# EAGLE design SpecialistEE20 (EAGLE 6.4)

## Sheet 1 of 4
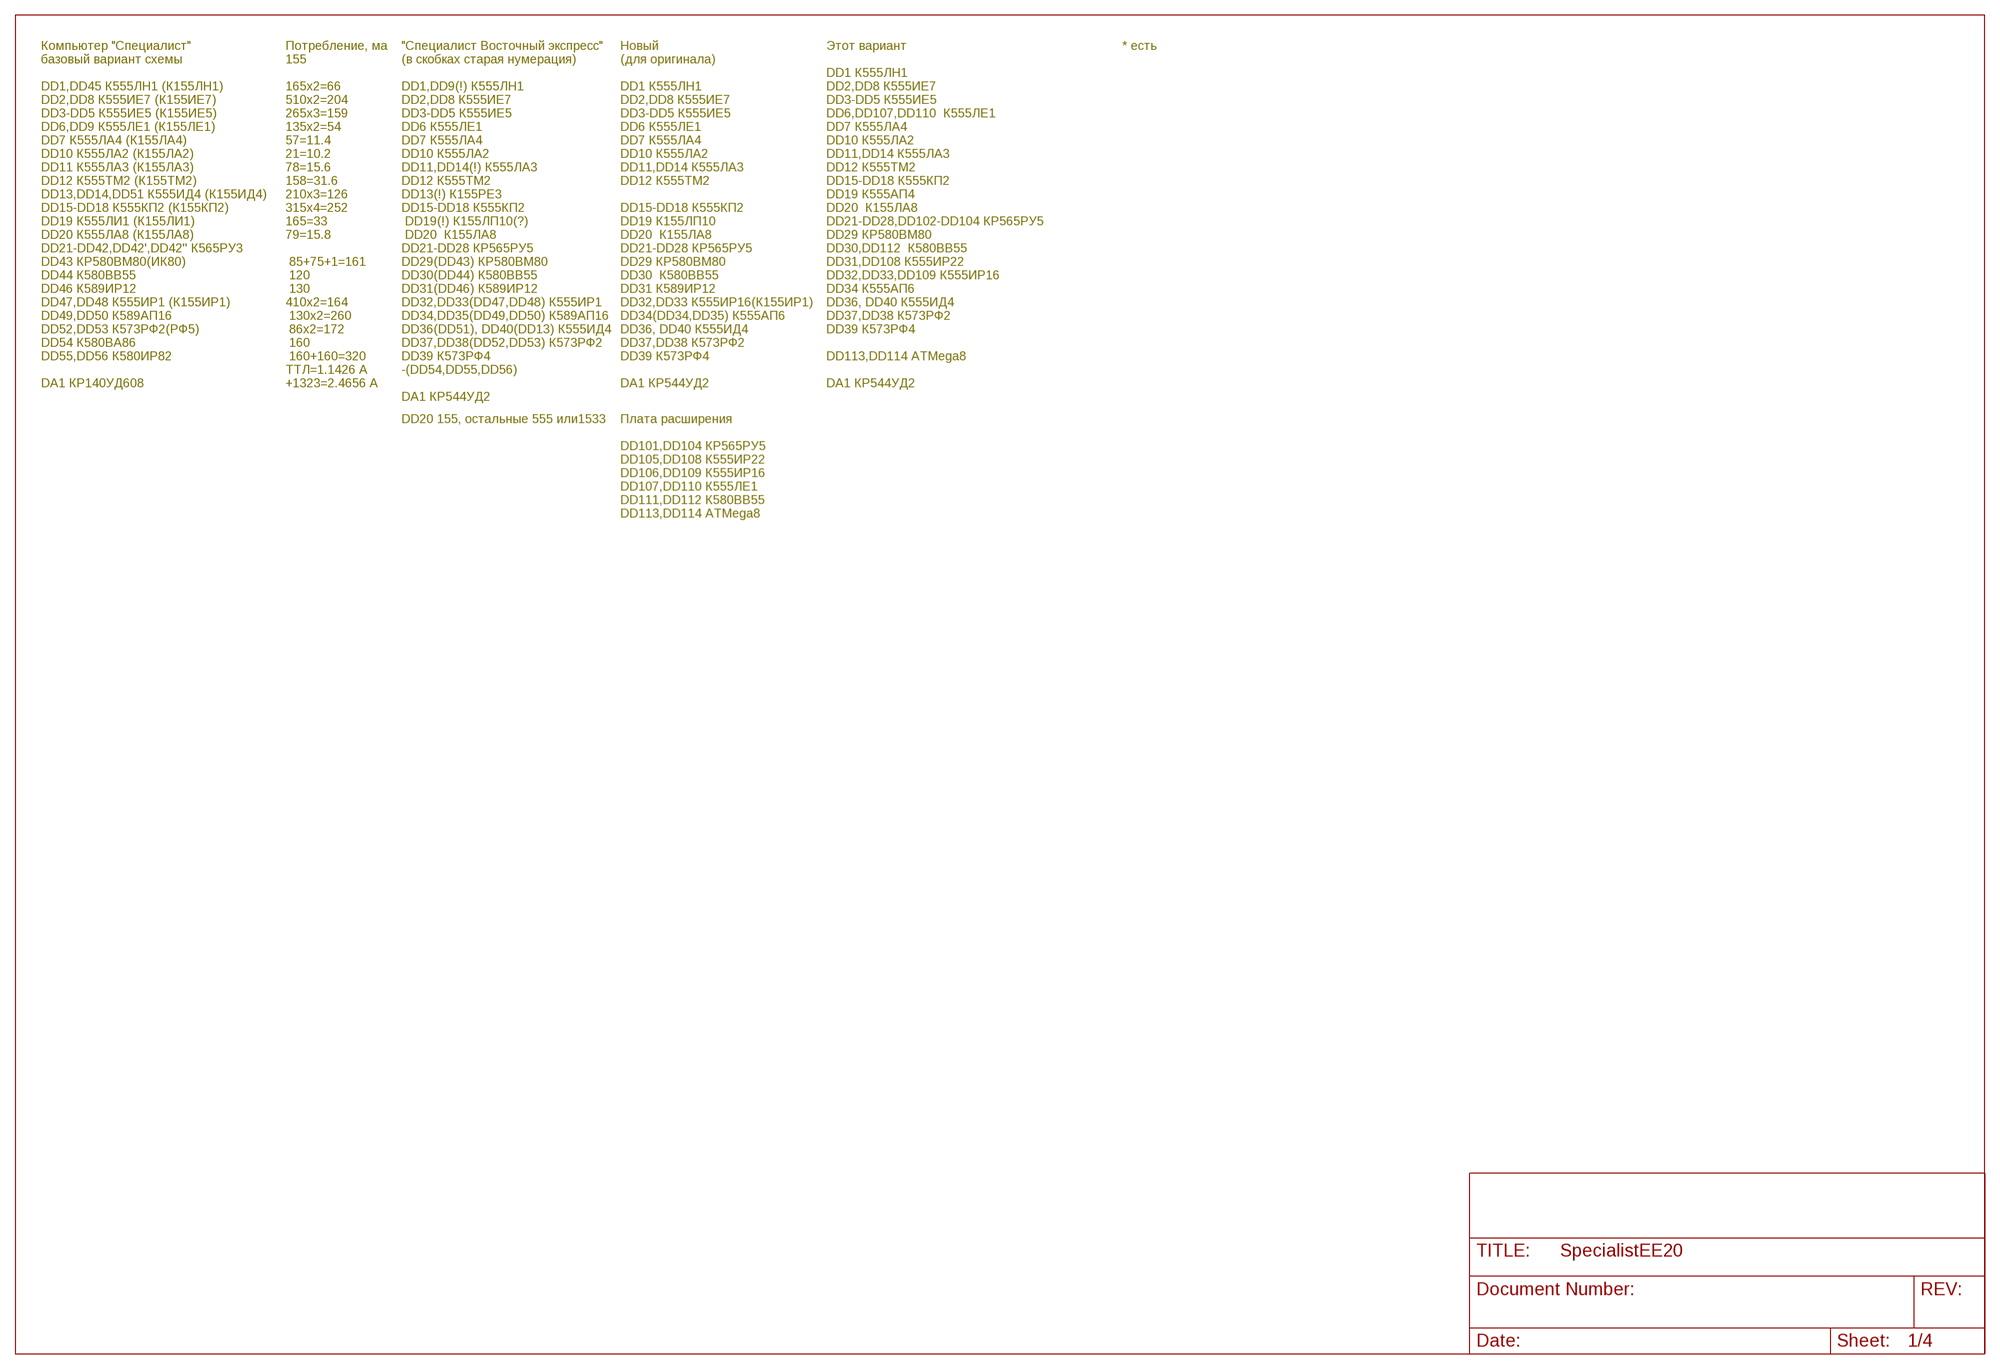
[diagram p0: schematic, sheet 1]

### Notes on the sheet
- Компьютер "Специалист"
  базовый вариант схемы
  
  DD1,DD45 К555ЛН1 (К155ЛН1)
  DD2,DD8 К555ИЕ7 (К155ИЕ7)
  DD3-DD5 К555ИЕ5 (К155ИЕ5)
  DD6,DD9 К555ЛЕ1 (К155ЛЕ1)
  DD7 К555ЛА4 (К155ЛА4)
  DD10 К555ЛА2 (К155ЛА2)
  DD11 К555ЛА3 (К155ЛА3)
  DD12 К555ТМ2 (К155ТМ2)
  DD13,DD14,DD51 К555ИД4 (К155ИД4)
  DD15-DD18 К555КП2 (К155КП2)
  DD19 К555ЛИ1 (К155ЛИ1)
  DD20 К555ЛА8 (К155ЛА8)
  DD21-DD42,DD42',DD42'' К565РУ3
  DD43 КР580ВМ80(ИК80)
  DD44 К580ВВ55
  DD46 К589ИР12
  DD47,DD48 К555ИР1 (К155ИР1)
  DD49,DD50 К589АП16
  DD52,DD53 К573РФ2(РФ5)
  DD54 К580ВА86
  DD55,DD56 К580ИР82
  
  DA1 КР140УД608
- Потребление, ма
  155 
  
  165х2=66
  510х2=204
  265х3=159
  135х2=54
  57=11.4
  21=10.2
  78=15.6
  158=31.6
  210х3=126
  315х4=252
  165=33
  79=15.8
  
   85+75+1=161
   120
   130
  410х2=164
   130х2=260
   86х2=172
   160
   160+160=320
  ТТЛ=1.1426 А
  +1323=2.4656 А
- "Специалист Восточный экспресс"
  (в скобках старая нумерация)
  
  DD1,DD9(!) К555ЛН1
  DD2,DD8 К555ИЕ7
  DD3-DD5 К555ИЕ5
  DD6 К555ЛЕ1
  DD7 К555ЛА4
  DD10 К555ЛА2
  DD11,DD14(!) К555ЛА3
  DD12 К555ТМ2
  DD13(!) К155РЕ3
  DD15-DD18 К555КП2
   DD19(!) К155ЛП10(?)
   DD20  К155ЛА8
  DD21-DD28 КР565РУ5
  DD29(DD43) КР580ВМ80
  DD30(DD44) К580ВВ55
  DD31(DD46) К589ИР12
  DD32,DD33(DD47,DD48) К555ИР1
  DD34,DD35(DD49,DD50) К589АП16
  DD36(DD51), DD40(DD13) К555ИД4 
  DD37,DD38(DD52,DD53) К573РФ2
  DD39 К573РФ4
  -(DD54,DD55,DD56)
  
  DA1 КР544УД2
- Новый
  (для оригинала)
  
  DD1 К555ЛН1
  DD2,DD8 К555ИЕ7
  DD3-DD5 К555ИЕ5
  DD6 К555ЛЕ1
  DD7 К555ЛА4
  DD10 К555ЛА2
  DD11,DD14 К555ЛА3
  DD12 К555ТМ2
  
  DD15-DD18 К555КП2
  DD19 К155ЛП10
  DD20  К155ЛА8
  DD21-DD28 КР565РУ5
  DD29 КР580ВМ80
  DD30  К580ВВ55
  DD31 К589ИР12
  DD32,DD33 К555ИР16(К155ИР1)
  DD34(DD34,DD35) К555АП6
  DD36, DD40 К555ИД4 
  DD37,DD38 К573РФ2
  DD39 К573РФ4
  
  DA1 КР544УД2
- Этот вариант
  
  DD1 К555ЛН1
  DD2,DD8 К555ИЕ7
  DD3-DD5 К555ИЕ5
  DD6,DD107,DD110  К555ЛЕ1
  DD7 К555ЛА4
  DD10 К555ЛА2
  DD11,DD14 К555ЛА3
  DD12 К555ТМ2
  DD15-DD18 К555КП2
  DD19 К555АП4
  DD20  К155ЛА8
  DD21-DD28,DD102-DD104 КР565РУ5
  DD29 КР580ВМ80
  DD30,DD112  К580ВВ55
  DD31,DD108 К555ИР22
  DD32,DD33,DD109 К555ИР16
  DD34 К555АП6
  DD36, DD40 К555ИД4 
  DD37,DD38 К573РФ2
  DD39 К573РФ4
  
  DD113,DD114 ATMega8
  
  DA1 КР544УД2
- * есть
- DD20 155, остальные 555 или1533
- Плата расширения
  
  DD101,DD104 КР565РУ5
  DD105,DD108 К555ИР22
  DD106,DD109 К555ИР16
  DD107,DD110 К555ЛЕ1
  DD111,DD112 К580ВВ55
  DD113,DD114 ATMega8

## Sheet 2 of 4
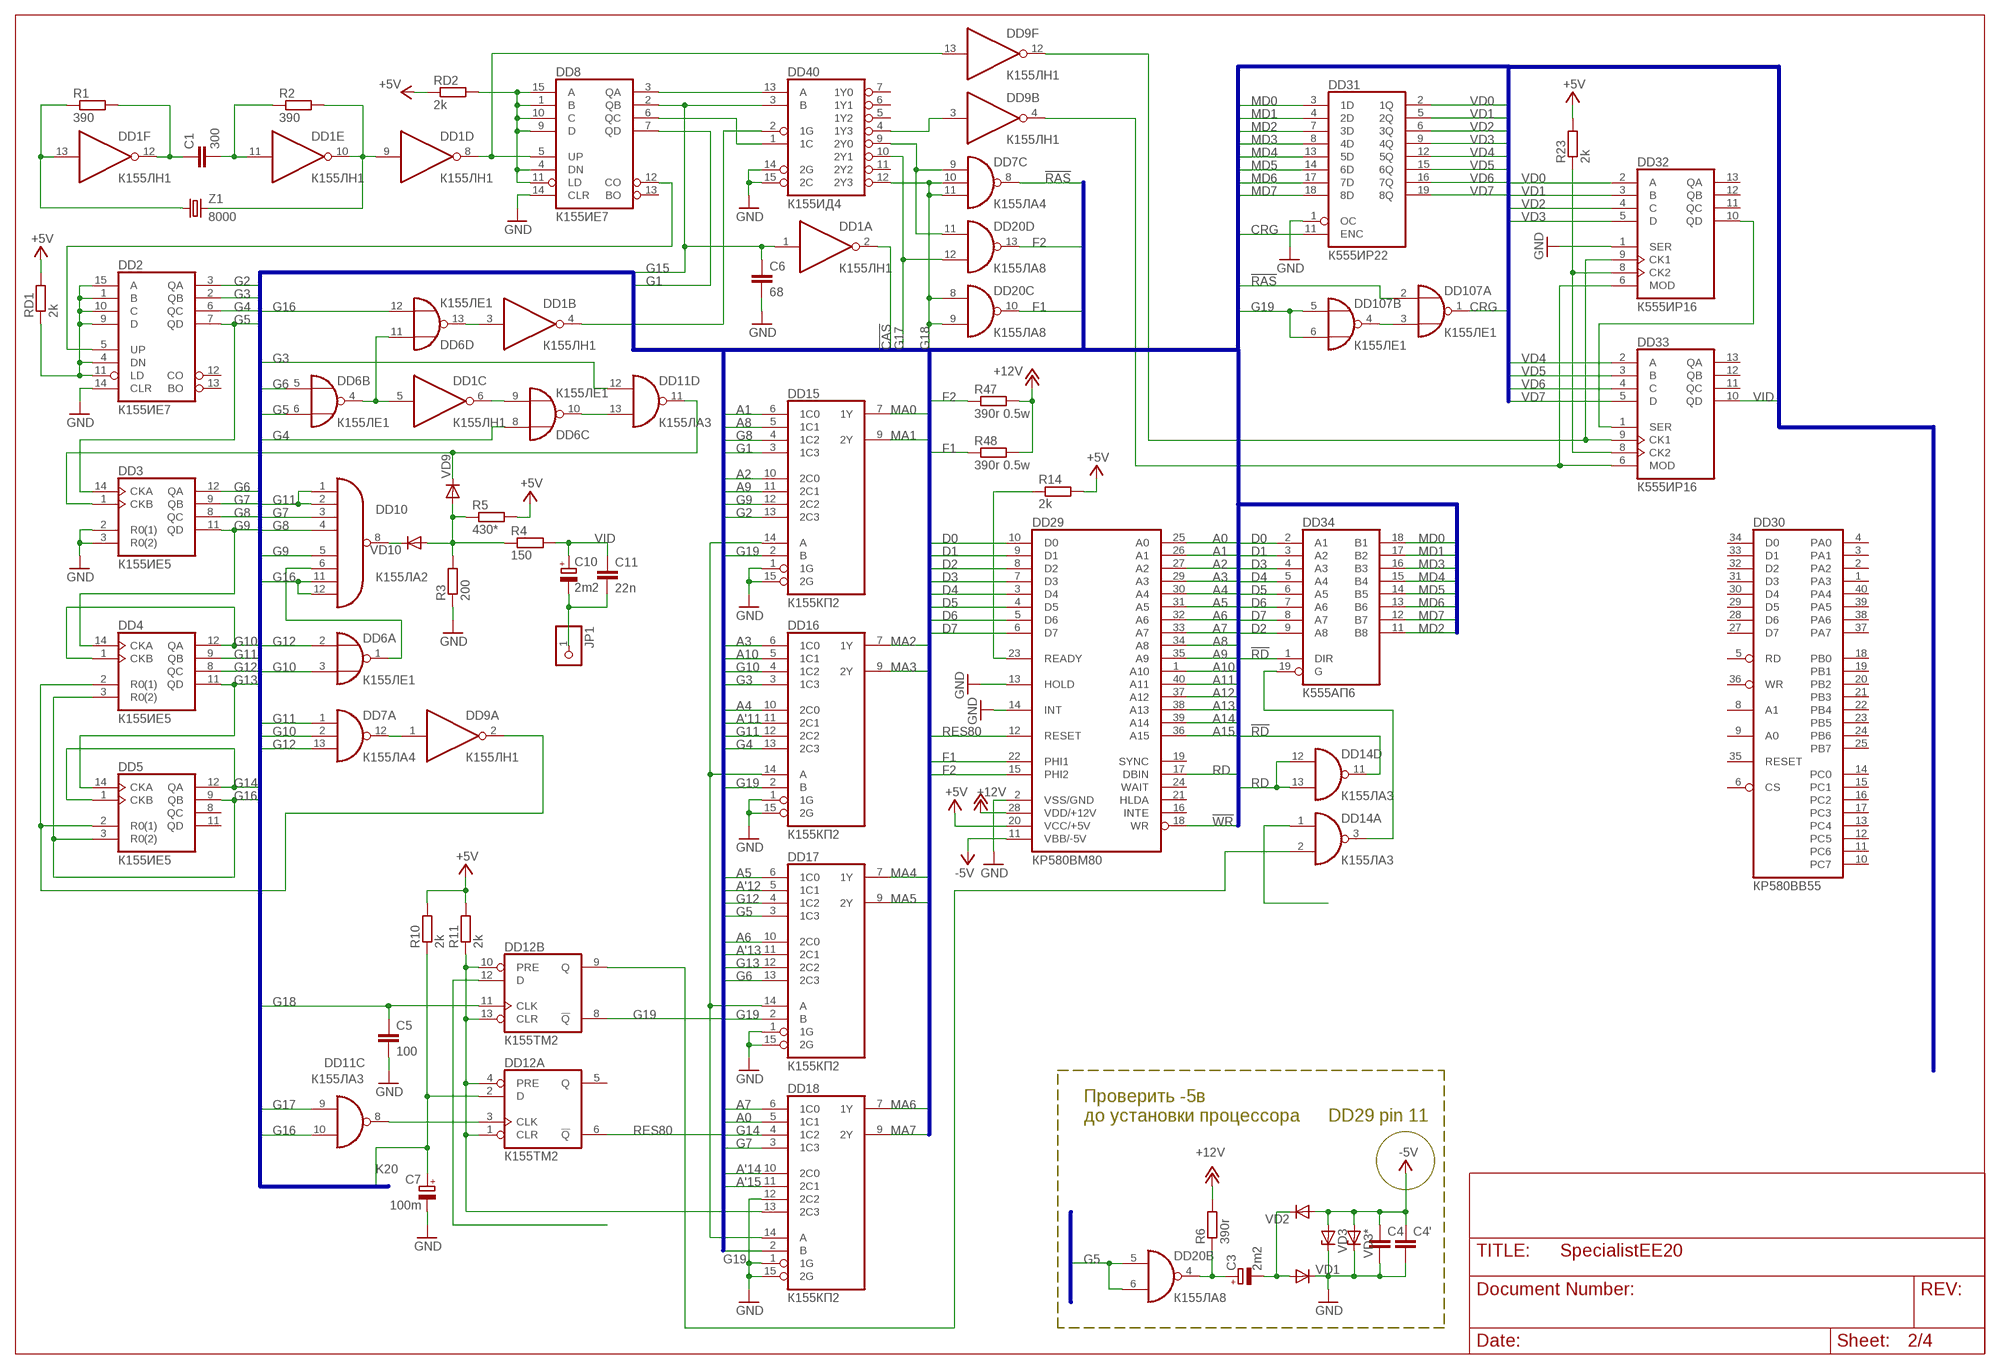
[diagram p1: schematic, sheet 2]

### Parts
C1  300  C-EUC0805  [C0805]
C3  2m2  CPOL-EUE2.5-5  [E2,5-5]
C4  C-EUC1206  [C1206]
C4'  C-EUC1206  [C1206]
C5  100  C-EUC0805  [C0805]
C6  68  C-EUC0805  [C0805]
C7  100m  CPOL-EUE2.5-5  [E2,5-5]
C10  2m2  CPOL-EUE2.5-5  [E2,5-5]
C11  22n  C-EUC0805  [C0805]
DD1  К155ЛН1  7404N  [DIL14]
DD2  К155ИЕ7  74192N  [DIL16]
DD3  К155ИЕ5  74LS93N  [DIL14]
DD4  К155ИЕ5  74LS93N  [DIL14]
DD5  К155ИЕ5  74LS93N  [DIL14]
DD6  К155ЛЕ1  7402N  [DIL14]
DD7  К155ЛА4  7410N  [DIL14]
DD8  К155ИЕ7  74192N  [DIL16]
DD9  К155ЛН1  7404N  [DIL14]
DD10  К155ЛА2  7430N  [DIL14]
DD11  К155ЛА3  7400N  [DIL14]
DD12  К155ТМ2  74S74N  [DIL14]
DD14  К155ЛА3  7400N  [DIL14]
DD15  К155КП2  74S153N  [DIL16]
DD16  К155КП2  74S153N  [DIL16]
DD17  К155КП2  74S153N  [DIL16]
DD18  К155КП2  74S153N  [DIL16]
DD20  К155ЛА8  74LS01N  [DIL14]
DD29  КР580ВМ80  8080  [DIL40]
DD30  КР580ВВ55  8255A  [DIL40]
DD31  К555ИР22  74LS373N  [DIL20]
DD32  К555ИР16  7495N  [DIL14]
DD33  К555ИР16  7495N  [DIL14]
DD34  К555АП6  74LS245N  [DIL20]
DD40  К155ИД4  74LS155N  [DIL16]
DD107  К155ЛЕ1  7402N  [DIL14]
JP1  PINHD-1X1  [1X01]
R1  390  R-EU_M1206  [M1206]
R2  390  R-EU_M1206  [M1206]
R3  200  R-EU_M1206  [M1206]
R4  150  R-EU_M1206  [M1206]
R5  430*  R-EU_M1206  [M1206]
R6  390r  R-EU_0411/15  [0411/15]
R10  2k  R-EU_M1206  [M1206]
R11  2k  R-EU_M1206  [M1206]
R14  2k  R-EU_M1206  [M1206]
R23  2k  R-EU_M1206  [M1206]
R47  390r 0.5w  R-EU_0411/15  [0411/15]
R48  390r 0.5w  R-EU_0411/15  [0411/15]
RD1  2k  R-EU_M1206  [M1206]
RD2  2k  R-EU_M1206  [M1206]
VD1  DIODE-SOD80C  [SOD80C]
VD2  DIODE-SOD80C  [SOD80C]
VD3  ZENER-DIODESOD80C  [SOD80C]
VD3*  ZENER-DIODESOD80C  [SOD80C]
VD9  DIODE-SOD80C  [SOD80C]
VD10  DIODE-SOD80C  [SOD80C]
Z1  8000  CRYSTALHC49S  [HC49/S]

### Nets
!CAS: DD1.2(A:O) ; also sheet 3,4
!RAS: DD7.8(C:O) DD107.2(A:I0) ; also sheet 3,4
!RD: DD14.11(D:O) DD34.1(DIR) ; also sheet 4
!WR: DD29.18(WR) ; also sheet 4
+5V: DD29.20(VCC/+5V) R5.2 R10.2 R11.2 R14.2 R23.2 RD1.2 RD2.1 ; also sheet 3,4
+12V: DD29.28(VDD/+12V) R6.2 R47.2 R48.2 ; also sheet 3
-5V: C4'.1 C4.1 DD29.11(VBB/-5V) VD2.A VD3*.A VD3.A
A0: DD18.5(1C1) DD29.25(A0) ; also sheet 4
A1: DD15.6(1C0) DD29.26(A1) ; also sheet 4
A2: DD15.10(2C0) DD29.27(A2)
A3: DD16.6(1C0) DD29.29(A3)
A4: DD16.10(2C0) DD29.30(A4)
A5: DD17.6(1C0) DD29.31(A5)
A6: DD17.10(2C0) DD29.32(A6)
A7: DD18.6(1C0) DD29.33(A7)
A8: DD15.5(1C1) DD29.34(A8)
A9: DD15.11(2C1) DD29.35(A9)
A10: DD16.5(1C1) DD29.1(A10)
A11: DD29.40(A11)
A12: DD29.37(A12)
A13: DD29.38(A13)
A14: DD29.39(A14)
A15: DD29.36(A15)
A'11: DD16.11(2C1)
A'12: DD17.5(1C1)
A'13: DD17.11(2C1)
A'14: DD18.10(2C0)
A'15: DD18.11(2C1)
CRG: DD31.11(ENC) DD107.1(A:O) ; also sheet 4
D0: DD29.10(D0) DD34.2(A1) ; also sheet 4
D1: DD29.9(D1) DD34.3(A2) ; also sheet 4
D2: DD29.8(D2) DD34.9(A8) ; also sheet 4
D3: DD29.7(D3) DD34.4(A3) ; also sheet 4
D4: DD29.3(D4) DD34.5(A4) ; also sheet 4
D5: DD29.4(D5) DD34.6(A5) ; also sheet 4
D6: DD29.5(D6) DD34.7(A6) ; also sheet 4
D7: DD29.6(D7) DD34.8(A7) ; also sheet 4
F1: DD20.10(C:O) DD29.22(PHI1) R48.1
F2: DD20.13(D:O) DD29.15(PHI2) R47.1
G1: DD8.7(QD) DD15.3(1C3)
G2: DD2.3(QA) DD15.13(2C3)
G3: DD2.2(QB) DD11.12(D:I0) DD16.3(1C3)
G4: DD2.6(QC) DD6.8(C:I0) DD16.13(2C3)
G5: DD2.7(QD) DD3.14(CKA) DD6.6(B:I1) DD17.3(1C3) DD20.5(B:I0) DD20.6(B:I1)
G6: DD3.12(QA) DD6.5(B:I0) DD17.13(2C3)
G7: DD3.9(QB) DD10.3(I2) DD18.3(1C3)
G8: DD3.8(QC) DD10.4(I3) DD15.4(1C2)
G9: DD3.11(QD) DD4.14(CKA) DD10.5(I4) DD15.12(2C2)
G10: DD4.1(CKB) DD4.12(QA) DD6.3(A:I1) DD7.2(A:I1) DD16.4(1C2)
G11: DD4.9(QB) DD7.1(A:I0) DD10.1(I0) DD10.2(I1) DD16.12(2C2)
G12: DD4.8(QC) DD6.2(A:I0) DD7.13(A:I2) DD17.4(1C2)
G13: DD4.11(QD) DD5.14(CKA) DD17.12(2C2)
G14: DD5.1(CKB) DD5.12(QA) DD18.4(1C2)
G15: C6.1 DD1.1(A:I) DD8.2(QB) DD40.3(B)
G16: DD4.3(R0(2)) DD5.3(R0(2)) DD5.9(QB) DD6.12(D:I1) DD10.11(I6) DD10.12(I7) DD11.10(C:I1)
G17: DD11.9(C:I0) DD20.12(D:I1) DD40.10(2Y1)
G18: C5.1 DD7.10(C:I1) DD7.11(C:I2) DD12.11(B:CLK) DD20.8(C:I0) DD20.9(C:I1) DD40.12(2Y3)
G19: DD12.8(B:!Q) DD15.2(B) DD16.2(B) DD17.2(B) DD18.2(B) DD107.5(B:I0) DD107.6(B:I1)
GND: C4'.2 C4.2 C5.2 C6.2 C7.- DD2.14(CLR) DD3.2(R0(1)) DD3.3(R0(2)) DD8.14(CLR) DD15.1(1G) DD15.15(2G) DD16.1(1G) DD16.15(2G) DD17.1(1G) DD17.15(2G) DD18.1(1G) DD18.12(2C2) DD18.15(2G) DD29.2(VSS/GND) DD29.13(HOLD) DD29.14(INT) DD31.1(OC) DD32.1(SER) DD40.14(2G) DD40.15(2C) R3.1 VD1.C VD3*.C VD3.C ; also sheet 3,4
K20: C7.+ DD12.2(A:D) R10.1
MA0: DD15.7(1Y) ; also sheet 3,4
MA1: DD15.9(2Y) ; also sheet 3,4
MA2: DD16.7(1Y) ; also sheet 3,4
MA3: DD16.9(2Y) ; also sheet 3,4
MA4: DD17.7(1Y) ; also sheet 3,4
MA5: DD17.9(2Y) ; also sheet 3,4
MA6: DD18.7(1Y) ; also sheet 3,4
MA7: DD18.9(2Y) ; also sheet 3,4
MD0: DD31.3(1D) DD34.18(B1) ; also sheet 3
MD1: DD31.4(2D) DD34.17(B2) ; also sheet 3
MD2: DD31.7(3D) DD34.11(B8) ; also sheet 3
MD3: DD31.8(4D) DD34.16(B3) ; also sheet 3
MD4: DD31.13(5D) DD34.15(B4) ; also sheet 3
MD5: DD31.14(6D) DD34.14(B5) ; also sheet 3
MD6: DD31.17(7D) DD34.13(B6) ; also sheet 3
MD7: DD31.18(8D) DD34.12(B7) ; also sheet 3
N$1: DD6.10(C:O) DD11.13(D:I1)
N$2: DD1.5(C:I) DD6.4(B:O) DD6.11(D:I0)
N$3: DD1.13(F:I) R1.1 Z1.1
N$4: DD9.3(B:I) DD40.4(1Y3)
N$5: C1.1 DD1.12(F:O) R1.2
N$6: DD1.9(D:I) DD1.10(E:O) R2.2 Z1.2
N$7: C1.2 DD1.11(E:I) R2.1
N$8: DD1.8(D:O) DD8.5(UP) DD9.13(F:I)
N$11: DD2.5(UP) DD8.12(CO)
N$12: DD6.1(A:O) DD10.6(I5)
N$13: DD1.6(C:O) DD6.9(C:I1)
N$14: DD1.3(B:I) DD6.13(D:O)
N$16: DD4.2(R0(1)) DD5.2(R0(1)) DD9.2(A:O)
N$19: DD7.9(C:I0) DD20.11(D:I0) DD40.9(2Y0)
N$20: DD8.3(QA) DD40.13(A)
N$21: C3.+ DD20.4(B:O) R6.1
N$22: C3.- VD1.A VD2.C
N$23: DD8.6(QC) DD40.1(1C)
N$24: DD1.4(B:O) DD40.2(1G)
N$25: DD10.8(O) VD10.C
N$26: DD3.1(CKB) DD11.11(D:O) VD9.C
N$27: R3.2 R4.1 R5.1 VD9.A VD10.A
N$28: DD32.10(QD) DD33.1(SER)
N$29: DD2.1(B) DD2.4(DN) DD2.9(D) DD2.10(C) DD2.11(LD) DD2.15(A) RD1.1
N$31: DD12.1(A:CLR) DD12.4(A:PRE) DD12.10(B:PRE) DD12.13(B:CLR) DD18.13(2C3) R11.1
N$33: C10.- C11.2 JP1.1
N$34: DD11.8(C:O) DD12.3(A:CLK)
N$36: DD12.12(B:D)
N$37: DD7.12(A:O) DD9.1(A:I)
N$38: DD8.1(B) DD8.4(DN) DD8.9(D) DD8.10(C) DD8.11(LD) DD8.15(A) RD2.2
N$41: DD15.14(A) DD16.14(A) DD17.14(A) DD18.14(A)
N$44: DD107.3(A:I1) DD107.4(B:O)
N$49: DD32.8(CK2) DD33.8(CK2) R23.1
N$53: DD9.12(F:O) DD32.9(CK1) DD33.9(CK1)
N$57: DD9.4(B:O) DD32.6(MOD) DD33.6(MOD)
N$66: DD29.23(READY) R14.1
N$69: DD14.3(A:O) DD34.19(G)
N$70: DD12.9(B:Q) DD14.2(A:I1)
N$71: DD14.1(A:I0)
RD: DD14.12(D:I0) DD14.13(D:I1) DD29.17(DBIN)
RES80: DD12.6(A:!Q) DD29.12(RESET)
VD0: DD31.2(1Q) DD32.2(A)
VD1: DD31.5(2Q) DD32.3(B)
VD2: DD31.6(3Q) DD32.4(C)
VD3: DD31.9(4Q) DD32.5(D)
VD4: DD31.12(5Q) DD33.2(A)
VD5: DD31.15(6Q) DD33.3(B)
VD6: DD31.16(7Q) DD33.4(C)
VD7: DD31.19(8Q) DD33.5(D)
VID: C10.+ C11.1 DD33.10(QD) R4.2 ; also sheet 4
Unconnected: DD2.12(CO) DD2.13(BO) DD5.8(QC) DD5.11(QD) DD7.3(B:I0) DD7.4(B:I1) DD7.5(B:I2) DD7.6(B:O) DD8.13(BO) DD9.5(C:I) DD9.6(C:O) DD9.8(D:O) DD9.9(D:I) DD9.10(E:O) DD9.11(E:I) DD11.1(A:I0) DD11.2(A:I1) DD11.3(A:O) DD11.4(B:I0) DD11.5(B:I1) DD11.6(B:O) DD12.5(A:Q) DD14.4(B:I0) DD14.5(B:I1) DD14.6(B:O) DD14.8(C:O) DD14.9(C:I0) DD14.10(C:I1) DD20.1(A:O) DD20.2(A:I0) DD20.3(A:I1) DD29.16(INTE) DD29.19(SYNC) DD29.21(HLDA) DD29.24(WAIT) DD30.1(PA3) DD30.2(PA2) DD30.3(PA1) DD30.4(PA0) DD30.5(RD) DD30.6(CS) DD30.8(A1) DD30.9(A0) DD30.10(PC7) DD30.11(PC6) DD30.12(PC5) DD30.13(PC4) DD30.14(PC0) DD30.15(PC1) DD30.16(PC2) DD30.17(PC3) DD30.18(PB0) DD30.19(PB1) DD30.20(PB2) DD30.21(PB3) DD30.22(PB4) DD30.23(PB5) DD30.24(PB6) DD30.25(PB7) DD30.27(D7) DD30.28(D6) DD30.29(D5) DD30.30(D4) DD30.31(D3) DD30.32(D2) DD30.33(D1) DD30.34(D0) DD30.35(RESET) DD30.36(WR) DD30.37(PA7) DD30.38(PA6) DD30.39(PA5) DD30.40(PA4) DD32.11(QC) DD32.12(QB) DD32.13(QA) DD33.11(QC) DD33.12(QB) DD33.13(QA) DD40.5(1Y2) DD40.6(1Y1) DD40.7(1Y0) DD40.11(2Y2)

### Buses
A[0..15],A'[11..15],D[0..7],F[1..2],G[1..19],MA[0..7],MD[0..7],VD[0..11],!RAS,!CAS,CLK,!WE,!WR,X-----X,K[1..27],U7,!,U[6..7],!RESIN,RES,RES80,RD,!RD,B,G,R,B0,G0,R0,SND,VID,LED,P[1..24],R[1..2],CRG,SH,Q3

### Notes on the sheet
- Проверить -5в 
  до установки процессора
- DD29 pin 11

## Sheet 3 of 4
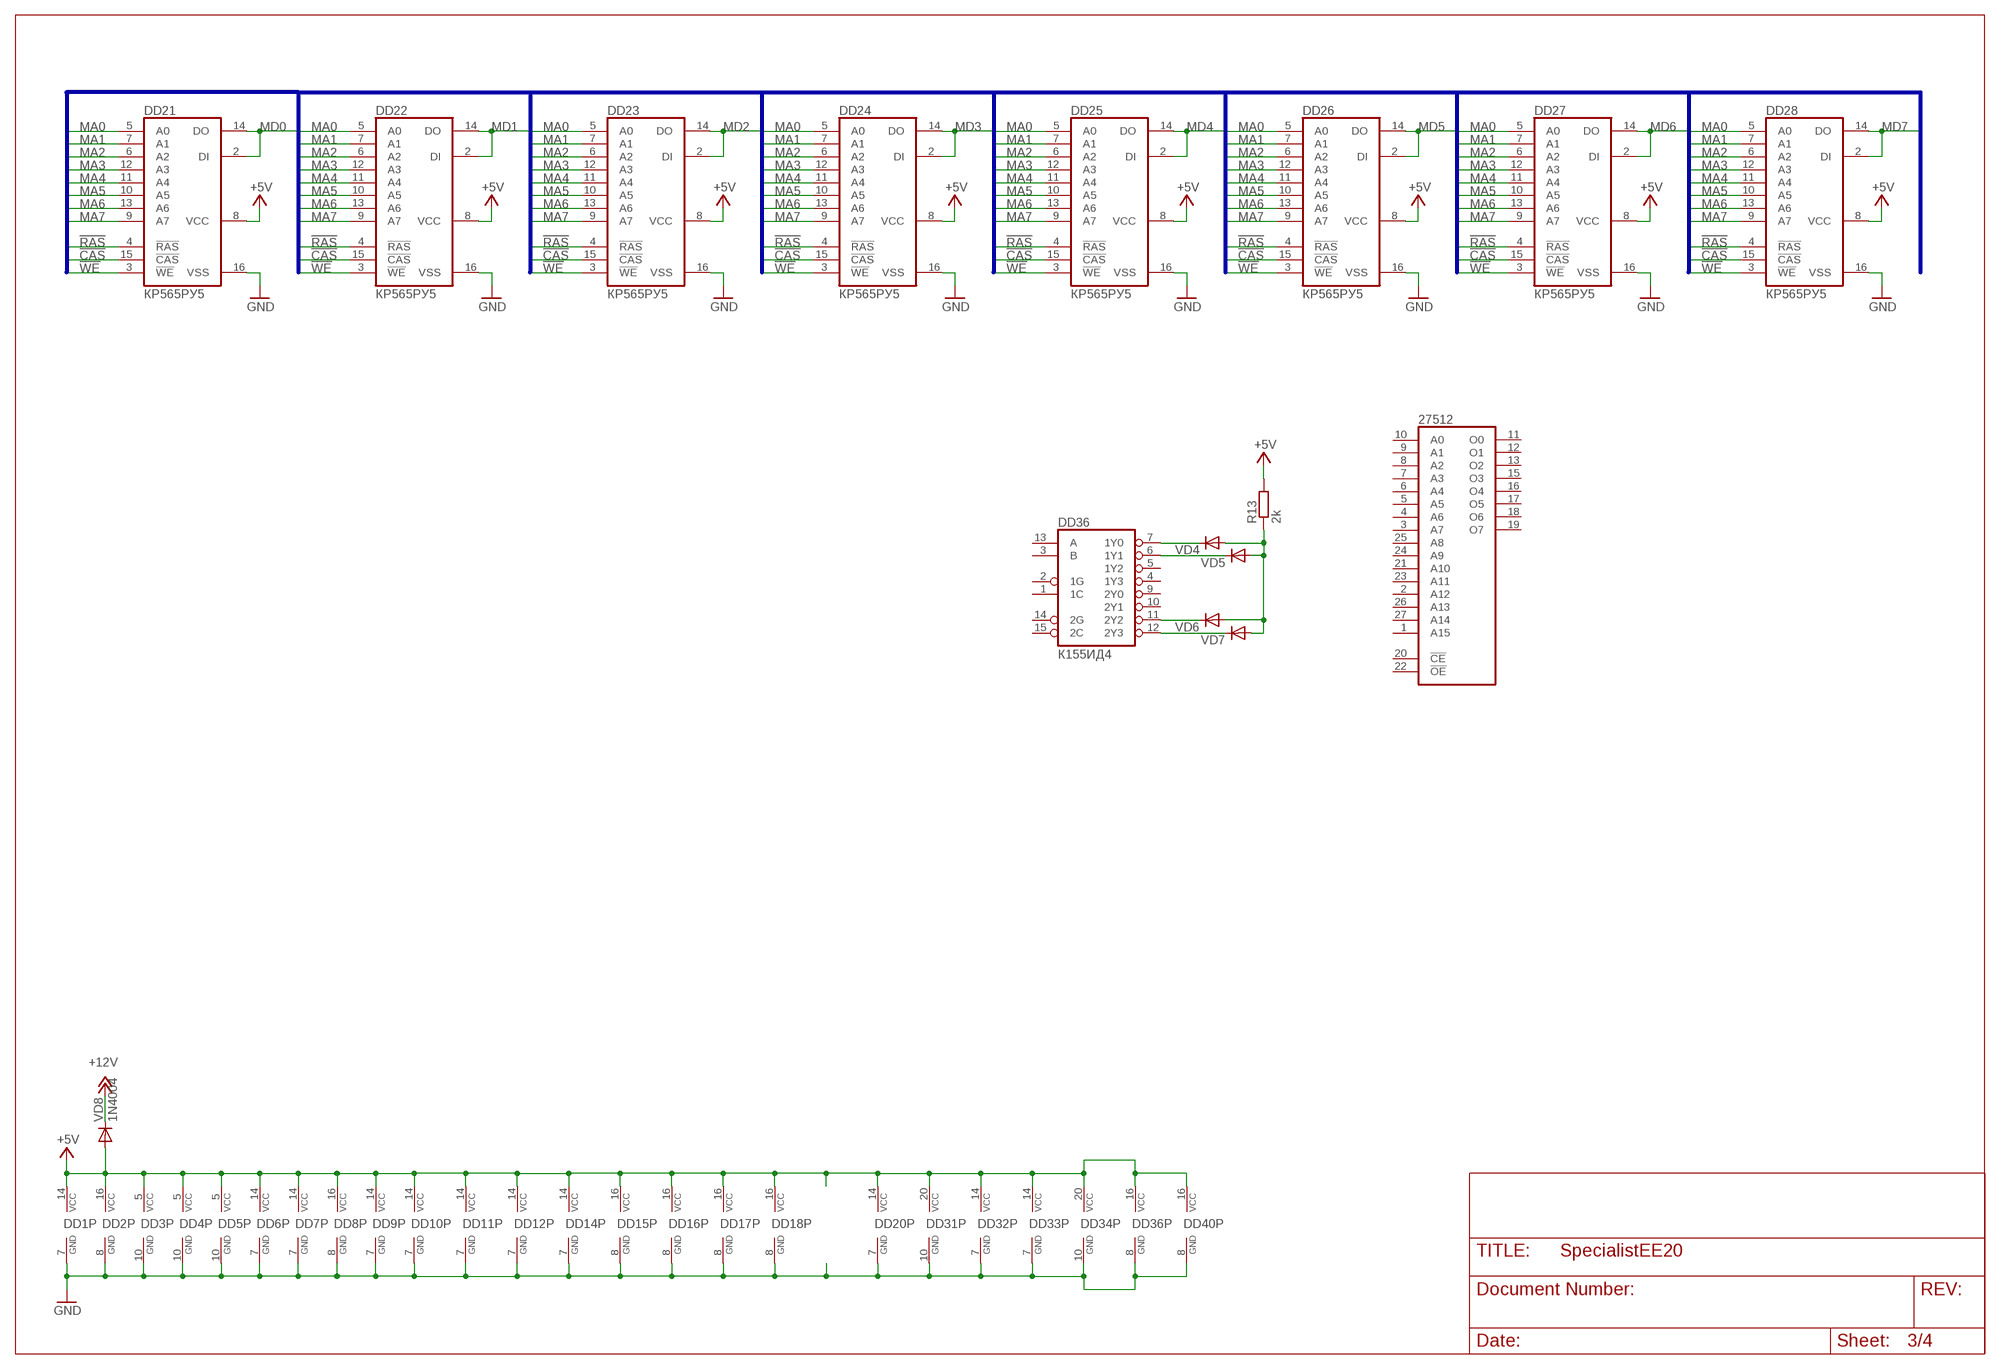
[diagram p2: schematic, sheet 3]

### Parts
27512  27512  [DIL28]
DD21  КР565РУ5  2164  [DIL16]
DD22  КР565РУ5  2164  [DIL16]
DD23  КР565РУ5  2164  [DIL16]
DD24  КР565РУ5  2164  [DIL16]
DD25  КР565РУ5  2164  [DIL16]
DD26  КР565РУ5  2164  [DIL16]
DD27  КР565РУ5  2164  [DIL16]
DD28  КР565РУ5  2164  [DIL16]
DD36  К155ИД4  74LS155N  [DIL16]
R13  2k  R-EU_M1206  [M1206]
VD4  DIODE-SOD80C  [SOD80C]
VD5  DIODE-SOD80C  [SOD80C]
VD6  DIODE-SOD80C  [SOD80C]
VD7  DIODE-SOD80C  [SOD80C]
VD8  1N4004  [DO41-10]

### Nets
!CAS: DD21.15(!CAS) DD22.15(!CAS) DD23.15(!CAS) DD24.15(!CAS) DD25.15(!CAS) DD26.15(!CAS) DD27.15(!CAS) DD28.15(!CAS) ; also sheet 2,4
!RAS: DD21.4(!RAS) DD22.4(!RAS) DD23.4(!RAS) DD24.4(!RAS) DD25.4(!RAS) DD26.4(!RAS) DD27.4(!RAS) DD28.4(!RAS) ; also sheet 2,4
!WE: DD21.3(!WE) DD22.3(!WE) DD23.3(!WE) DD24.3(!WE) DD25.3(!WE) DD26.3(!WE) DD27.3(!WE) DD28.3(!WE) ; also sheet 4
+5V: DD1.14(P:VCC) DD2.16(VCC) DD3.5(VCC) DD4.5(VCC) DD5.5(VCC) DD6.14(P:VCC) DD7.14(P:VCC) DD8.16(VCC) DD9.14(P:VCC) DD10.14(VCC) DD11.14(P:VCC) DD12.14(P:VCC) DD14.14(P:VCC) DD15.16(VCC) DD16.16(VCC) DD17.16(VCC) DD18.16(VCC) DD20.14(P:VCC) DD21.8(VCC) DD22.8(VCC) DD23.8(VCC) DD24.8(VCC) DD25.8(VCC) DD26.8(VCC) DD27.8(VCC) DD28.8(VCC) DD31.20(VCC) DD32.14(VCC) DD33.14(VCC) DD34.20(VCC) DD36.16(VCC) DD40.16(VCC) R13.2 VD8.A ; also sheet 2,4
+12V: VD8.C ; also sheet 2
GND: DD1.7(P:GND) DD2.8(GND) DD3.10(GND) DD4.10(GND) DD5.10(GND) DD6.7(P:GND) DD7.7(P:GND) DD8.8(GND) DD9.7(P:GND) DD10.7(GND) DD11.7(P:GND) DD12.7(P:GND) DD14.7(P:GND) DD15.8(GND) DD16.8(GND) DD17.8(GND) DD18.8(GND) DD20.7(P:GND) DD21.16(VSS) DD22.16(VSS) DD23.16(VSS) DD24.16(VSS) DD25.16(VSS) DD26.16(VSS) DD27.16(VSS) DD28.16(VSS) DD31.10(GND) DD32.7(GND) DD33.7(GND) DD34.10(GND) DD36.8(GND) DD40.8(GND) ; also sheet 2,4
MA0: DD21.5(A0) DD22.5(A0) DD23.5(A0) DD24.5(A0) DD25.5(A0) DD26.5(A0) DD27.5(A0) DD28.5(A0) ; also sheet 2,4
MA1: DD21.7(A1) DD22.7(A1) DD23.7(A1) DD24.7(A1) DD25.7(A1) DD26.7(A1) DD27.7(A1) DD28.7(A1) ; also sheet 2,4
MA2: DD21.6(A2) DD22.6(A2) DD23.6(A2) DD24.6(A2) DD25.6(A2) DD26.6(A2) DD27.6(A2) DD28.6(A2) ; also sheet 2,4
MA3: DD21.12(A3) DD22.12(A3) DD23.12(A3) DD24.12(A3) DD25.12(A3) DD26.12(A3) DD27.12(A3) DD28.12(A3) ; also sheet 2,4
MA4: DD21.11(A4) DD22.11(A4) DD23.11(A4) DD24.11(A4) DD25.11(A4) DD26.11(A4) DD27.11(A4) DD28.11(A4) ; also sheet 2,4
MA5: DD21.10(A5) DD22.10(A5) DD23.10(A5) DD24.10(A5) DD25.10(A5) DD26.10(A5) DD27.10(A5) DD28.10(A5) ; also sheet 2,4
MA6: DD21.13(A6) DD22.13(A6) DD23.13(A6) DD24.13(A6) DD25.13(A6) DD26.13(A6) DD27.13(A6) DD28.13(A6) ; also sheet 2,4
MA7: DD21.9(A7) DD22.9(A7) DD23.9(A7) DD24.9(A7) DD25.9(A7) DD26.9(A7) DD27.9(A7) DD28.9(A7) ; also sheet 2,4
MD0: DD21.2(DI) DD21.14(DO) ; also sheet 2
MD1: DD22.2(DI) DD22.14(DO) ; also sheet 2
MD2: DD23.2(DI) DD23.14(DO) ; also sheet 2
MD3: DD24.2(DI) DD24.14(DO) ; also sheet 2
MD4: DD25.2(DI) DD25.14(DO) ; also sheet 2
MD5: DD26.2(DI) DD26.14(DO) ; also sheet 2
MD6: DD27.2(DI) DD27.14(DO) ; also sheet 2
MD7: DD28.2(DI) DD28.14(DO) ; also sheet 2
N$9: DD36.7(1Y0) VD4.C
N$10: DD36.6(1Y1) VD5.C
N$15: DD36.11(2Y2) VD6.C
N$17: DD36.12(2Y3) VD7.C
N$18: R13.1 VD4.A VD5.A VD6.A VD7.A
Unconnected: 27512.1(A15) 27512.2(A12) 27512.3(A7) 27512.4(A6) 27512.5(A5) 27512.6(A4) 27512.7(A3) 27512.8(A2) 27512.9(A1) 27512.10(A0) 27512.11(O0) 27512.12(O1) 27512.13(O2) 27512.15(O3) 27512.16(O4) 27512.17(O5) 27512.18(O6) 27512.19(O7) 27512.20(!CE) 27512.21(A10) 27512.22(!OE) 27512.23(A11) 27512.24(A9) 27512.25(A8) 27512.26(A13) 27512.27(A14) DD36.1(1C) DD36.2(1G) DD36.3(B) DD36.4(1Y3) DD36.5(1Y2) DD36.9(2Y0) DD36.10(2Y1) DD36.13(A) DD36.14(2G) DD36.15(2C)

### Buses
A[0..15],A'[11..15],D[0..7],F[1..2],G[1..19],MA[0..7],MD[0..7],VD[0..11],!RAS,!CAS,CLK,!WE,!WR,X-----X,K[1..27],U7,!,U[6..7],!RESIN,RES,RES80,RD,!RD,B,G,R,B0,G0,R0,SND,VID,LED,P[1..24],R[1..2],CRG,SH,Q3

## Sheet 4 of 4
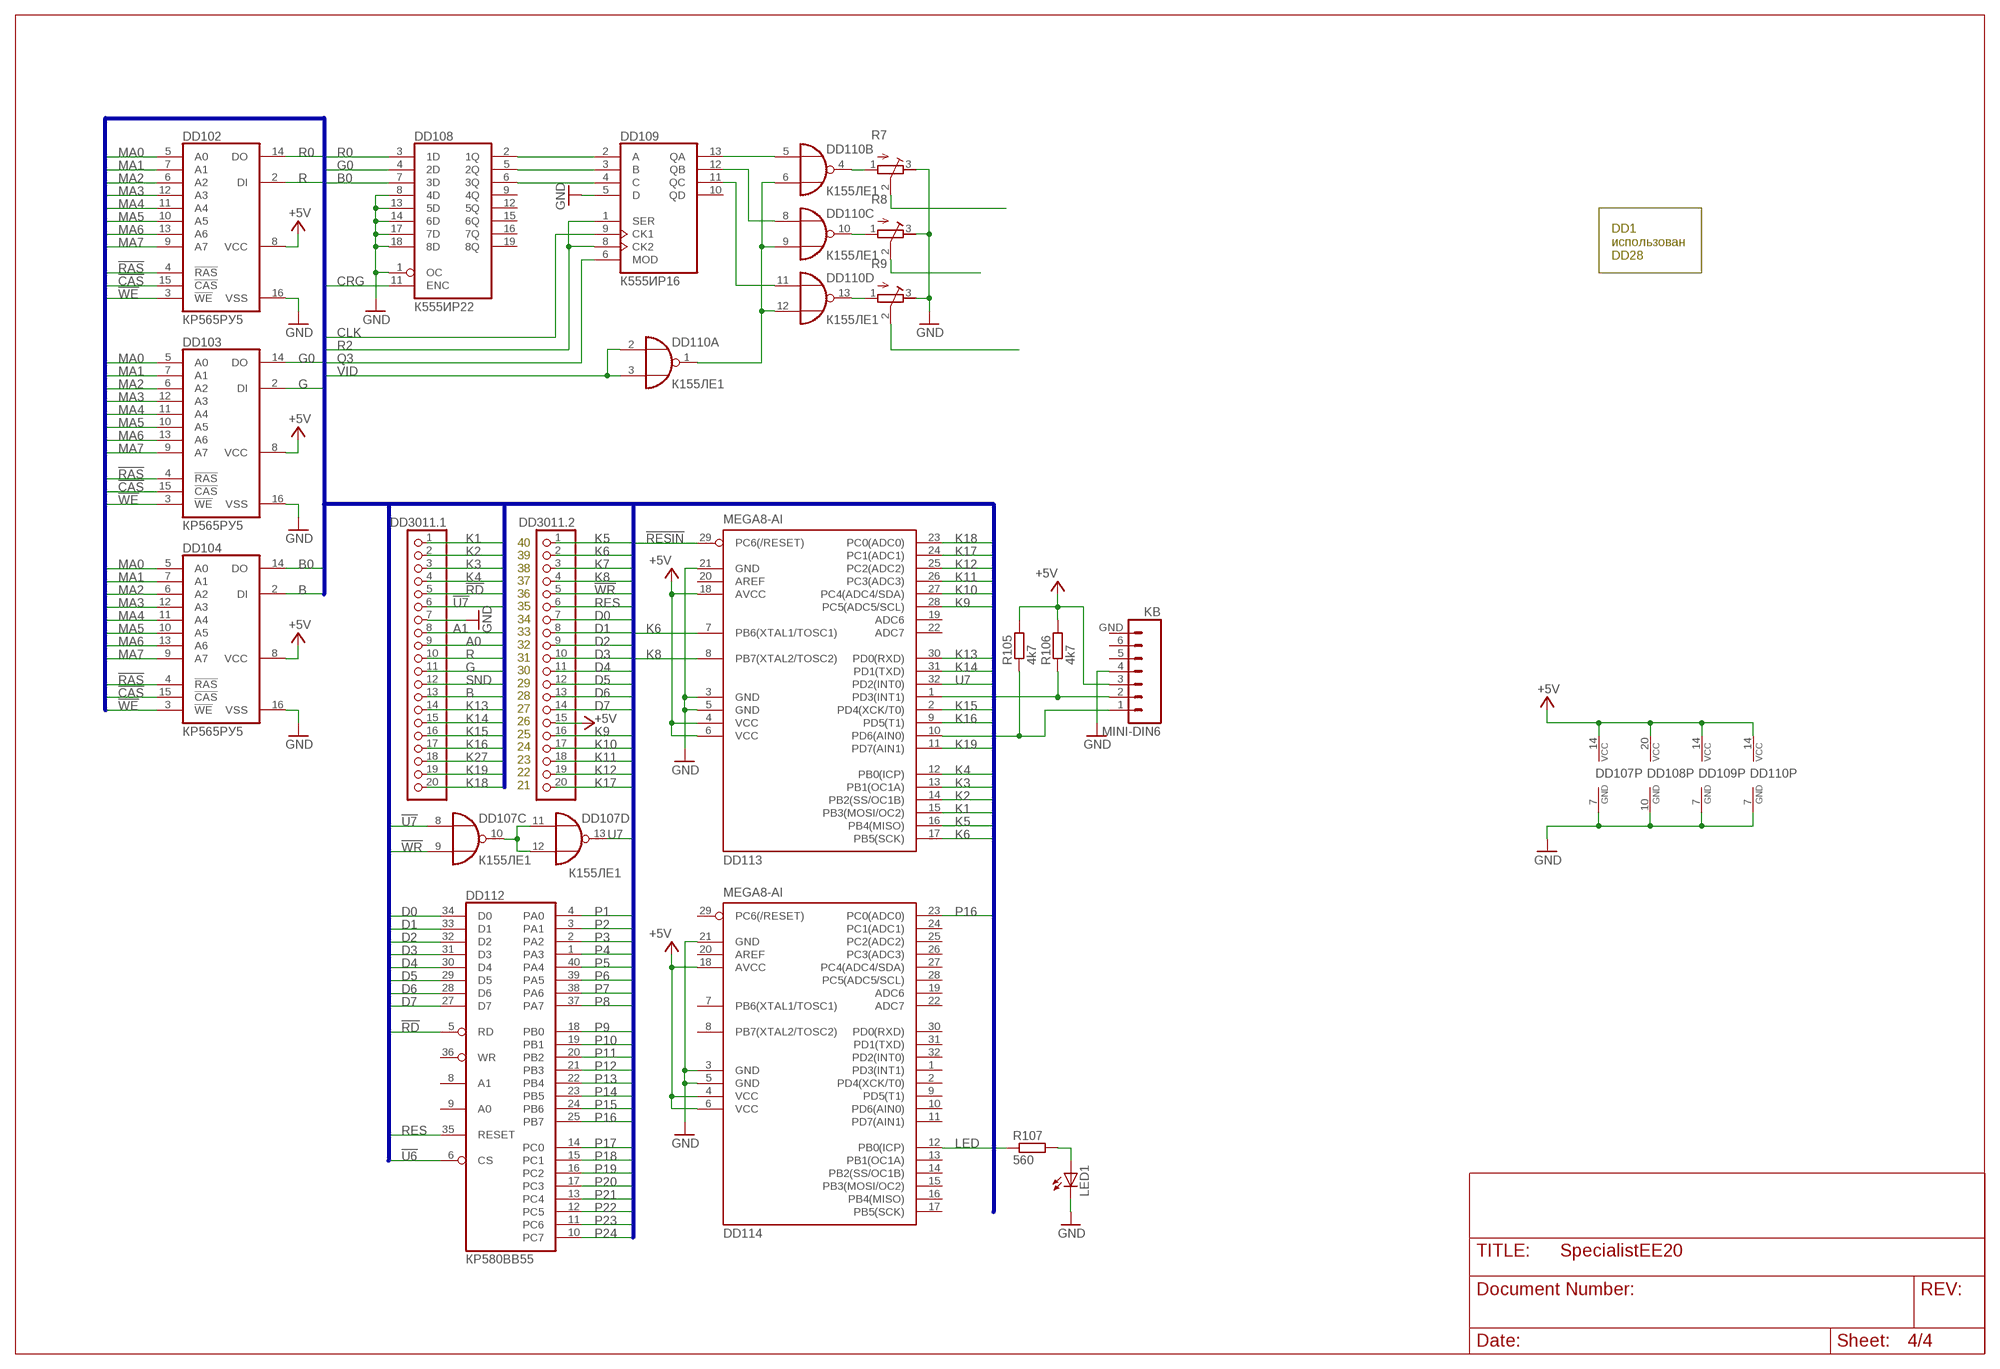
[diagram p3: schematic, sheet 4]

### Parts
DD102  КР565РУ5  2164  [DIL16]
DD103  КР565РУ5  2164  [DIL16]
DD104  КР565РУ5  2164  [DIL16]
DD108  К555ИР22  74LS373N  [DIL20]
DD109  К555ИР16  7495N  [DIL14]
DD110  К155ЛЕ1  7402N  [DIL14]
DD112  КР580ВВ55  8255A  [DIL40]
DD113  MEGA8-AI  [TQFP32-08]
DD114  MEGA8-AI  [TQFP32-08]
DD3011.1  PINHD-1X20  [1X20]
DD3011.2  PINHD-1X20  [1X20]
KB  MINI-DIN6  MINI-DIN6PTH  [MINI-DIN6]
LED1  LED5MM  [LED5MM]
R7  R-TRIMM3296W  [RTRIM3296W]
R8  R-TRIMM3296W  [RTRIM3296W]
R9  R-TRIMM3296W  [RTRIM3296W]
R105  4k7  R-EU_M0805  [M0805]
R106  4k7  R-EU_M0805  [M0805]
R107  560  R-EU_M0805  [M0805]

### Nets
!CAS: DD102.15(!CAS) DD103.15(!CAS) DD104.15(!CAS) ; also sheet 2,3
!RAS: DD102.4(!RAS) DD103.4(!RAS) DD104.4(!RAS) ; also sheet 2,3
!RD: DD112.5(RD) DD3011.1.5 ; also sheet 2
!RESIN: DD113.29(PC6(/RESET))
!U6: DD112.6(CS)
!U7: DD107.8(C:I0) DD3011.1.6
!WE: DD102.3(!WE) DD103.3(!WE) DD104.3(!WE) ; also sheet 3
!WR: DD107.9(C:I1) DD3011.2.5 ; also sheet 2
+5V: DD102.8(VCC) DD103.8(VCC) DD104.8(VCC) DD107.14(P:VCC) DD108.20(VCC) DD109.14(VCC) DD110.14(P:VCC) DD113.4(VCC) DD113.6(VCC) DD113.18(AVCC) DD114.4(VCC) DD114.6(VCC) DD114.18(AVCC) DD3011.2.15 KB.3 R105.2 R106.2 ; also sheet 2,3
A0: DD3011.1.9 ; also sheet 2
A1: DD3011.1.8 ; also sheet 2
B: DD104.2(DI) DD3011.1.13
B0: DD104.14(DO) DD108.7(3D)
CLK: DD109.9(CK1)
CRG: DD108.11(ENC) ; also sheet 2
D0: DD112.34(D0) DD3011.2.7 ; also sheet 2
D1: DD112.33(D1) DD3011.2.8 ; also sheet 2
D2: DD112.32(D2) DD3011.2.9 ; also sheet 2
D3: DD112.31(D3) DD3011.2.10 ; also sheet 2
D4: DD112.30(D4) DD3011.2.11 ; also sheet 2
D5: DD112.29(D5) DD3011.2.12 ; also sheet 2
D6: DD112.28(D6) DD3011.2.13 ; also sheet 2
D7: DD112.27(D7) DD3011.2.14 ; also sheet 2
G: DD103.2(DI) DD3011.1.11
G0: DD103.14(DO) DD108.4(2D)
GND: DD102.16(VSS) DD103.16(VSS) DD104.16(VSS) DD107.7(P:GND) DD108.1(OC) DD108.8(4D) DD108.10(GND) DD108.13(5D) DD108.14(6D) DD108.17(7D) DD108.18(8D) DD109.5(D) DD109.7(GND) DD110.7(P:GND) DD113.3(GND) DD113.5(GND) DD113.21(GND) DD114.3(GND) DD114.5(GND) DD114.21(GND) DD3011.1.7 KB.4 LED1.K(C) R7.3(E) R8.3(E) R9.3(E) ; also sheet 2,3
K1: DD113.15(PB3(MOSI/OC2)) DD3011.1.1
K2: DD113.14(PB2(SS/OC1B)) DD3011.1.2
K3: DD113.13(PB1(OC1A)) DD3011.1.3
K4: DD113.12(PB0(ICP)) DD3011.1.4
K5: DD113.16(PB4(MISO)) DD3011.2.1
K6: DD113.7(PB6(XTAL1/TOSC1)) DD113.17(PB5(SCK)) DD3011.2.2
K7: DD3011.2.3
K8: DD113.8(PB7(XTAL2/TOSC2)) DD3011.2.4
K9: DD113.28(PC5(ADC5/SCL)) DD3011.2.16
K10: DD113.27(PC4(ADC4/SDA)) DD3011.2.17
K11: DD113.26(PC3(ADC3)) DD3011.2.18
K12: DD113.25(PC2(ADC2)) DD3011.2.19
K13: DD113.30(PD0(RXD)) DD3011.1.14
K14: DD113.31(PD1(TXD)) DD3011.1.15
K15: DD113.2(PD4(XCK/T0)) DD3011.1.16
K16: DD113.9(PD5(T1)) DD3011.1.17
K17: DD113.24(PC1(ADC1)) DD3011.2.20
K18: DD113.23(PC0(ADC0)) DD3011.1.20
K19: DD113.11(PD7(AIN1)) DD3011.1.19
K27: DD3011.1.18
LED: DD114.12(PB0(ICP)) R107.1
MA0: DD102.5(A0) DD103.5(A0) DD104.5(A0) ; also sheet 2,3
MA1: DD102.7(A1) DD103.7(A1) DD104.7(A1) ; also sheet 2,3
MA2: DD102.6(A2) DD103.6(A2) DD104.6(A2) ; also sheet 2,3
MA3: DD102.12(A3) DD103.12(A3) DD104.12(A3) ; also sheet 2,3
MA4: DD102.11(A4) DD103.11(A4) DD104.11(A4) ; also sheet 2,3
MA5: DD102.10(A5) DD103.10(A5) DD104.10(A5) ; also sheet 2,3
MA6: DD102.13(A6) DD103.13(A6) DD104.13(A6) ; also sheet 2,3
MA7: DD102.9(A7) DD103.9(A7) DD104.9(A7) ; also sheet 2,3
N$35: DD113.1(PD3(INT1)) KB.2 R106.1
N$39: DD113.10(PD6(AIN0)) KB.1 R105.1
N$40: DD107.10(C:O) DD107.11(D:I0) DD107.12(D:I1)
N$42: DD110.1(A:O) DD110.6(B:I1) DD110.9(C:I1) DD110.12(D:I1)
N$43: DD108.2(1Q) DD109.2(A)
N$45: DD108.5(2Q) DD109.3(B)
N$46: DD108.6(3Q) DD109.4(C)
N$48: LED1.A R107.2
N$50: DD109.13(QA) DD110.5(B:I0)
N$51: DD109.12(QB) DD110.8(C:I0)
N$52: DD109.11(QC) DD110.11(D:I0)
N$54: DD110.4(B:O) R7.1(A)
N$55: DD110.10(C:O) R8.1(A)
N$56: DD110.13(D:O) R9.1(A)
N$58: R7.2(S)
N$59: R8.2(S)
N$60: R9.2(S)
P1: DD112.4(PA0)
P2: DD112.3(PA1)
P3: DD112.2(PA2)
P4: DD112.1(PA3)
P5: DD112.40(PA4)
P6: DD112.39(PA5)
P7: DD112.38(PA6)
P8: DD112.37(PA7)
P9: DD112.18(PB0)
P10: DD112.19(PB1)
P11: DD112.20(PB2)
P12: DD112.21(PB3)
P13: DD112.22(PB4)
P14: DD112.23(PB5)
P15: DD112.24(PB6)
P16: DD112.25(PB7) DD114.23(PC0(ADC0))
P17: DD112.14(PC0)
P18: DD112.15(PC1)
P19: DD112.16(PC2)
P20: DD112.17(PC3)
P21: DD112.13(PC4)
P22: DD112.12(PC5)
P23: DD112.11(PC6)
P24: DD112.10(PC7)
Q3: DD109.6(MOD)
R: DD102.2(DI) DD3011.1.10
R0: DD102.14(DO) DD108.3(1D)
R2: DD109.1(SER) DD109.8(CK2)
RES: DD112.35(RESET) DD3011.2.6
SND: DD3011.1.12
U7: DD107.13(D:O) DD113.32(PD2(INT0))
VID: DD110.2(A:I0) DD110.3(A:I1) ; also sheet 2
Unconnected: DD108.9(4Q) DD108.12(5Q) DD108.15(6Q) DD108.16(7Q) DD108.19(8Q) DD109.10(QD) DD112.8(A1) DD112.9(A0) DD112.36(WR) DD113.19(ADC6) DD113.20(AREF) DD113.22(ADC7) DD114.1(PD3(INT1)) DD114.2(PD4(XCK/T0)) DD114.7(PB6(XTAL1/TOSC1)) DD114.8(PB7(XTAL2/TOSC2)) DD114.9(PD5(T1)) DD114.10(PD6(AIN0)) DD114.11(PD7(AIN1)) DD114.13(PB1(OC1A)) DD114.14(PB2(SS/OC1B)) DD114.15(PB3(MOSI/OC2)) DD114.16(PB4(MISO)) DD114.17(PB5(SCK)) DD114.19(ADC6) DD114.20(AREF) DD114.22(ADC7) DD114.24(PC1(ADC1)) DD114.25(PC2(ADC2)) DD114.26(PC3(ADC3)) DD114.27(PC4(ADC4/SDA)) DD114.28(PC5(ADC5/SCL)) DD114.29(PC6(/RESET)) DD114.30(PD0(RXD)) DD114.31(PD1(TXD)) DD114.32(PD2(INT0)) KB.5 KB.6 KB.GND

### Buses
A[0..15],A'[11..15],D[0..7],F[1..2],G[1..19],MA[0..7],MD[0..7],VD[0..11],!RAS,!CAS,CLK,!WE,!WR,X-----X,K[1..27],U7,!,U[6..7],!RESIN,RES,RES80,RD,!RD,B,G,R,B0,G0,R0,SND,VID,LED,P[1..24],R[1..2],CRG,SH,Q3

### Notes on the sheet
- DD1
  использован
  DD28
- 40
  39
  38
  37
  36
  35
  34
  33
  32
  31
  30
  29
  28
  27
  26
  25
  24
  23
  22
  21

## Power pins joined to a net without a drawn wire
GND: 27512.14(GND) DD30.7(GND) DD112.7(GND)
VCC: 27512.28(VCC) DD30.26(VCC) DD112.26(VCC)

## Library data of the parts
27512 = memory:27512: MEMORY
C1 C4 C4' C5 C6 C11 = rcl:C-EU: CAPACITOR, European symbol
C3 C7 C10 = rcl:CPOL-EU: POLARIZED CAPACITOR, European symbol
DD1 DD9 = 74xx-eu:74*04: Hex INVERTER
DD2 DD8 = 74xx-eu:74*192: Synchronous 4-bit UP/DOWN COUNTER
DD3-DD5 = 74xx-eu:74*93: Decade, divide by twelve and binary COUNTER
DD6 DD107 DD110 = 74xx-eu:74*02: Quad 2-input NOR gate
DD7 = 74xx-eu:74*10: Triple 3-input NAND gate
DD10 = 74xx-eu:74*30: 8-input NAND gate
DD11 DD14 = 74xx-eu:74*00: Quad 2-input NAND gate
DD12 = 74xx-eu:74*74: Dual D type positive edge triggered FLIP FLOP, preset and clear
DD15-DD18 = 74xx-eu:74*153: Dual 4-line to 1-line data SELECTOR/MULTIPLEXER
DD20 = 74xx-eu:74*01: Quad 2-input NAND gate, open collector
DD21-DD28 DD102-DD104 = memory:2164: MEMORY
DD29 = micro-intel:8080: MICROCOMPUTER/PERIPHERAL DEVICE; OC_FARNELL: unknown; OC_NEWARK: unknown
DD30 DD112 = micro-intel:8255A: MICROCOMPUTER/PERIPHERAL DEVICE; OC_FARNELL: unknown; OC_NEWARK: unknown
DD31 DD108 = 74xx-eu:74*373: Octal D type transparent LATCH, edge triggered
DD32 DD33 DD109 = 74xx-eu:74*95: 4-bit parallel access SHIFT REGISTER
DD34 = 74xx-eu:74*245: Octal BUS TRANSCEIVER, 3-state
DD36 DD40 = 74xx-eu:74*155: Dual 2-line to 4-line data DECODER/DEMULTIPLEXER
DD113 DD114 = atmel:MEGA8: MICROCONTROLLER 8 Kbytes FLASH, 1 kbytes SRAM, 512 bytes EEPROM, USART, 6-channel 10 bit ADC, 2-channel 8 bit ADC Pin compatible with Atmega48, ATMega88, ATMega168 Source: avr.lbr; MPN: ATMEGA8-16AU; OC_FARNELL: 9171371; OC_NEWARK: 73M8863
DD3011.1 DD3011.2 = Разъёмы штырьковые 2.54мм:PINHD-1X20: PIN HEADER
JP1 = Разъёмы штырьковые 2.54мм:PINHD-1X1: PIN HEADER
KB = Speccy:MINI-DIN6: mini DIN 6 Connector Commonly found on the back of a computer for PS2 keyboard and mice. Schematic and footprint are proven. Spark Fun Electronics SKU : PRT-08509
LED1 = led:LED: LED OSRAM: - CHIPLED LG R971, LG N971, LY N971, LG Q971, LY Q971, LO R971, LY R971 LH N974, LH R974 LS Q976, LO Q976, LY Q976 LO Q996 - Hyper CHIPLED LW Q18S LB Q993, LB Q99A, LB R99A - SideLED LS A670, LO A670, LY A670, LG A670, LP A670 LB A673, LV A673, LT A673, LW A673 LH A674 LY A675 LS A676, LA A676, LO A676, LY A676, LW A676 LS A679, LY A679, LG A679 - Hyper Micro SIDELED® LS Y876, LA Y876, LO Y876, LY Y876 LT Y87S - SmartLED LW L88C, LW L88S LB L89C, LB L89S, LG L890 LS L89K, LO L89K, LY L89K LS L896, LA L896, LO L896, LY L896 - TOPLED LS T670, LO T670, LY T670, LG T670, LP T670 LSG T670, LSP T670, LSY T670, LOP T670, LYG T670 LG T671, LOG T671, LSG T671 LB T673, LV T673, LT T673, LW T673 LH T674 LS T676, LA T676, LO T676, LY T676, LB T676, LH T676, LSB T676, LW T676 LB T67C, LV T67C, LT T67C, LS T67K, LO T67K, LY T67K, LW E67C LS E67B, LA E67B, LO E67B, LY E67B, LB E67C, LV E67C, LT E67C LW T67C LS T679, LY T679, LG T679 LS T770, LO T770, LY T770, LG T770, LP T770 LB T773, LV T773, LT T773, LW T773 LH T774 LS E675, LA E675, LY E675, LS T675 LS T776, LA T776, LO T776, LY T776, LB T776 LHGB T686 LT T68C, LB T68C - Hyper Mini TOPLED® LB M676 - Mini TOPLED Santana® LG M470 LS M47K, LO M47K, LY M47K Source: http://www.osram.convergy.de LUXEON: - LUMILED® LXK2-PW12-R00, LXK2-PW12-S00, LXK2-PW14-U00, LXK2-PW14-V00 LXK2-PM12-R00, LXK2-PM12-S00, LXK2-PM14-U00 LXK2-PE12-Q00, LXK2-PE12-R00, LXK2-PE12-S00, LXK2-PE14-T00, LXK2-PE14-U00 LXK2-PB12-K00, LXK2-PB12-L00, LXK2-PB12-M00, LXK2-PB14-N00, LXK2-PB14-P00, LXK2-PB14-Q00 LXK2-PR12-L00, LXK2-PR12-M00, LXK2-PR14-Q00, LXK2-PR14-R00 LXK2-PD12-Q00, LXK2-PD12-R00, LXK2-PD12-S00 LXK2-PH12-R00, LXK2-PH12-S00 LXK2-PL12-P00, LXK2-PL12-Q00, LXK2-PL12-R00 Source: www.luxeon.com KINGBRIGHT: KA-3528ASYC Source: www.kingbright.com
R1-R6 R10 R11 R13 R14 R23 R47 R48 R105-R107 RD1 RD2 = rcl:R-EU_: RESISTOR, European symbol
R7-R9 = rcl:R-TRIMM: Trimm resistor
VD1 VD2 VD4-VD7 VD9 VD10 = diode:DIODE-: DIODE
VD3 VD3* = diode:ZENER-DIODE: Z-Diode
VD8 = diode:1N4004: DIODE general purpose rectifier, 1 A
Z1 = crystal:CRYSTAL: CRYSTAL; OC_FARNELL: 1667008; OC_NEWARK: unknown

## Board
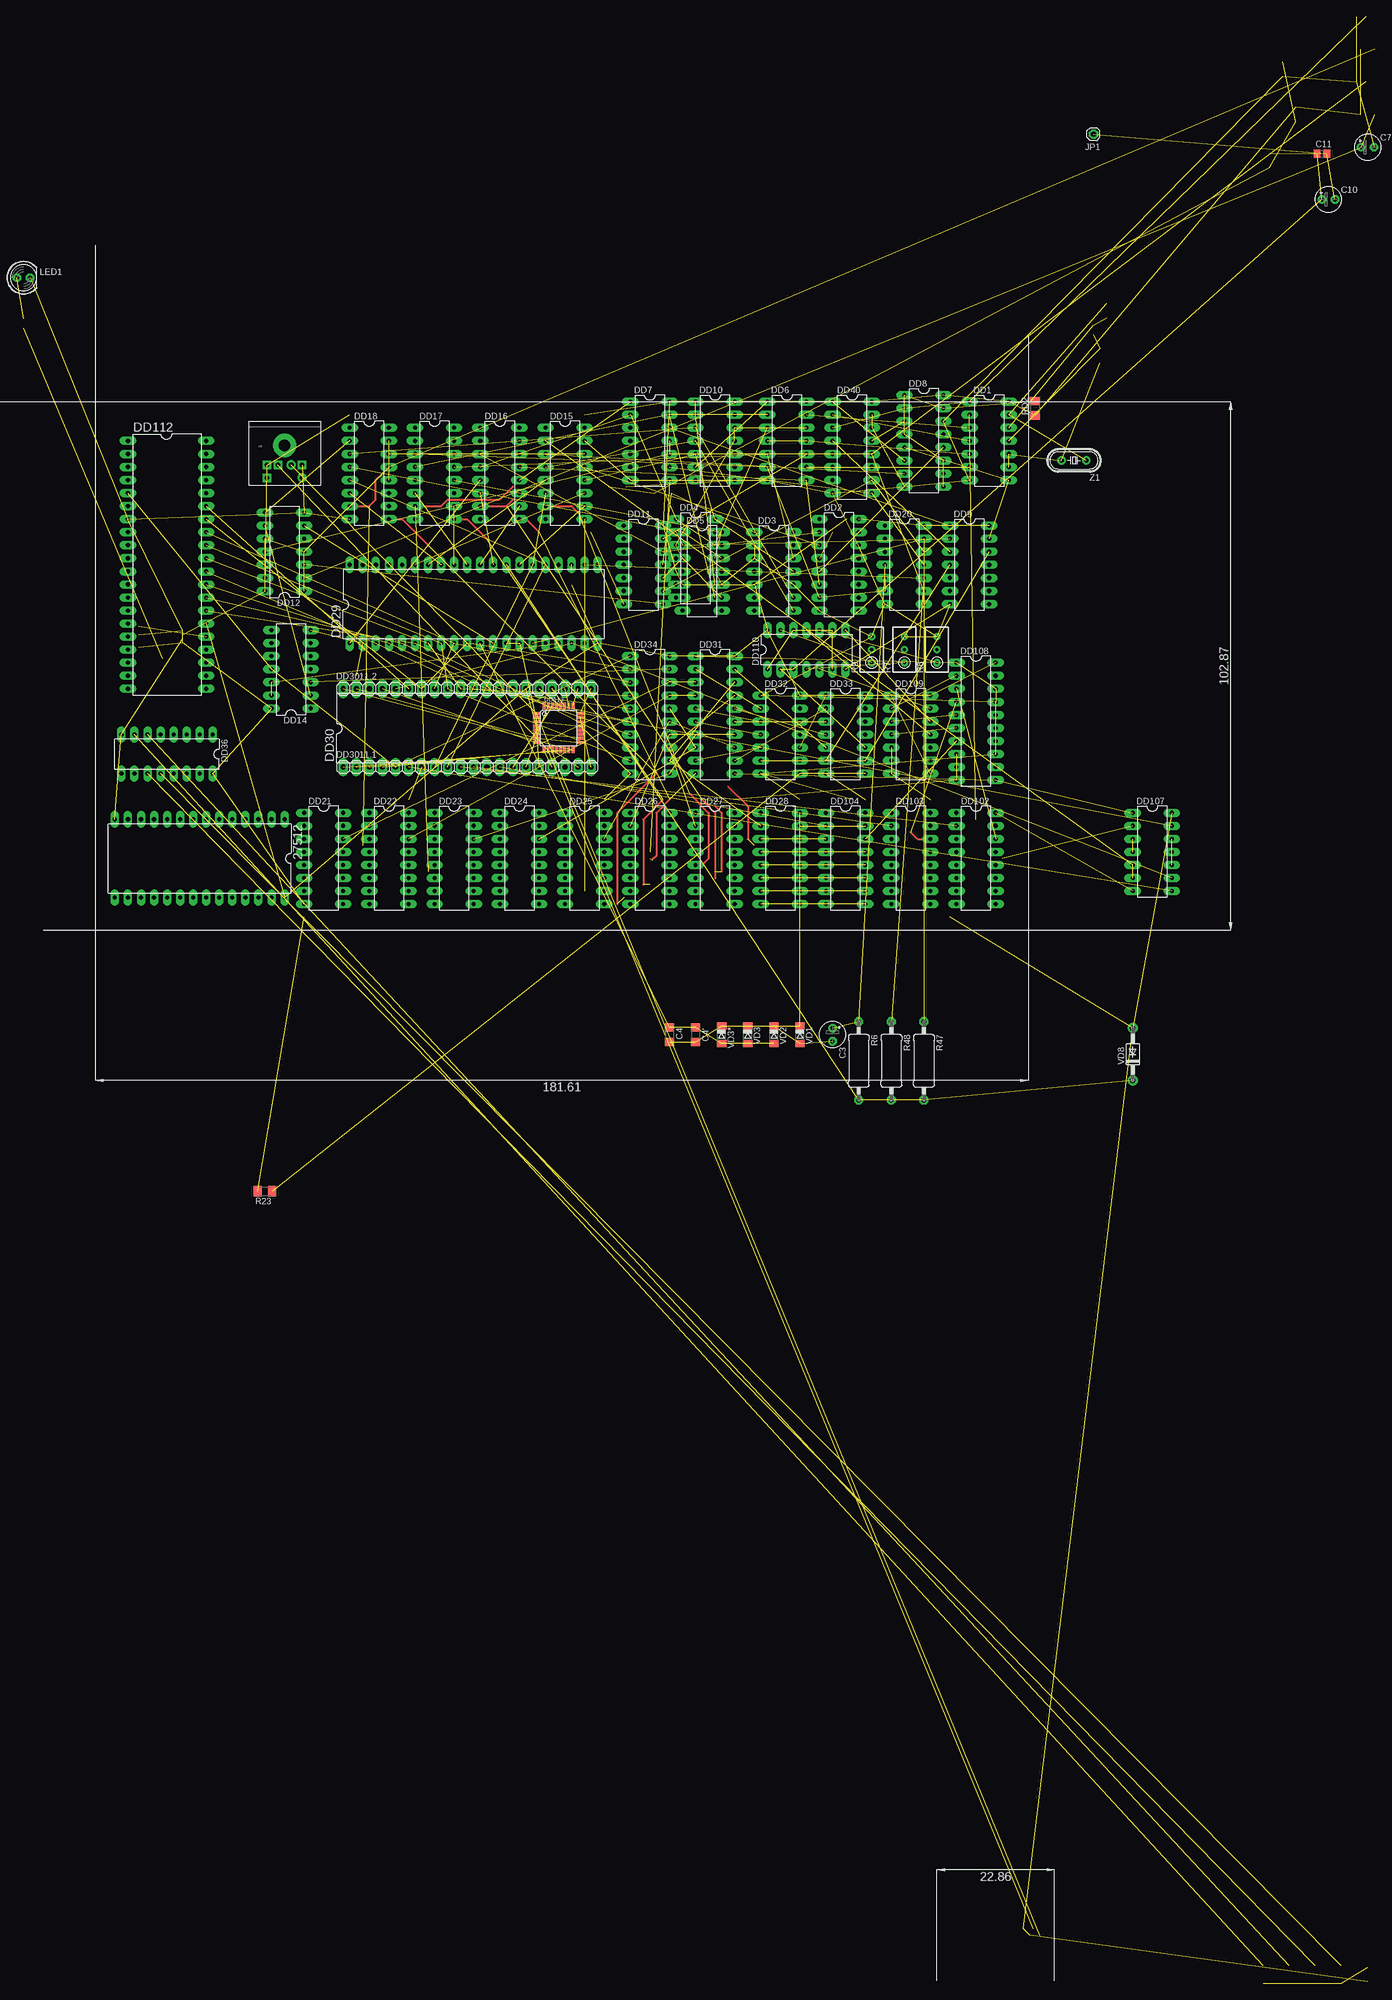
[diagram p4: board, top side]
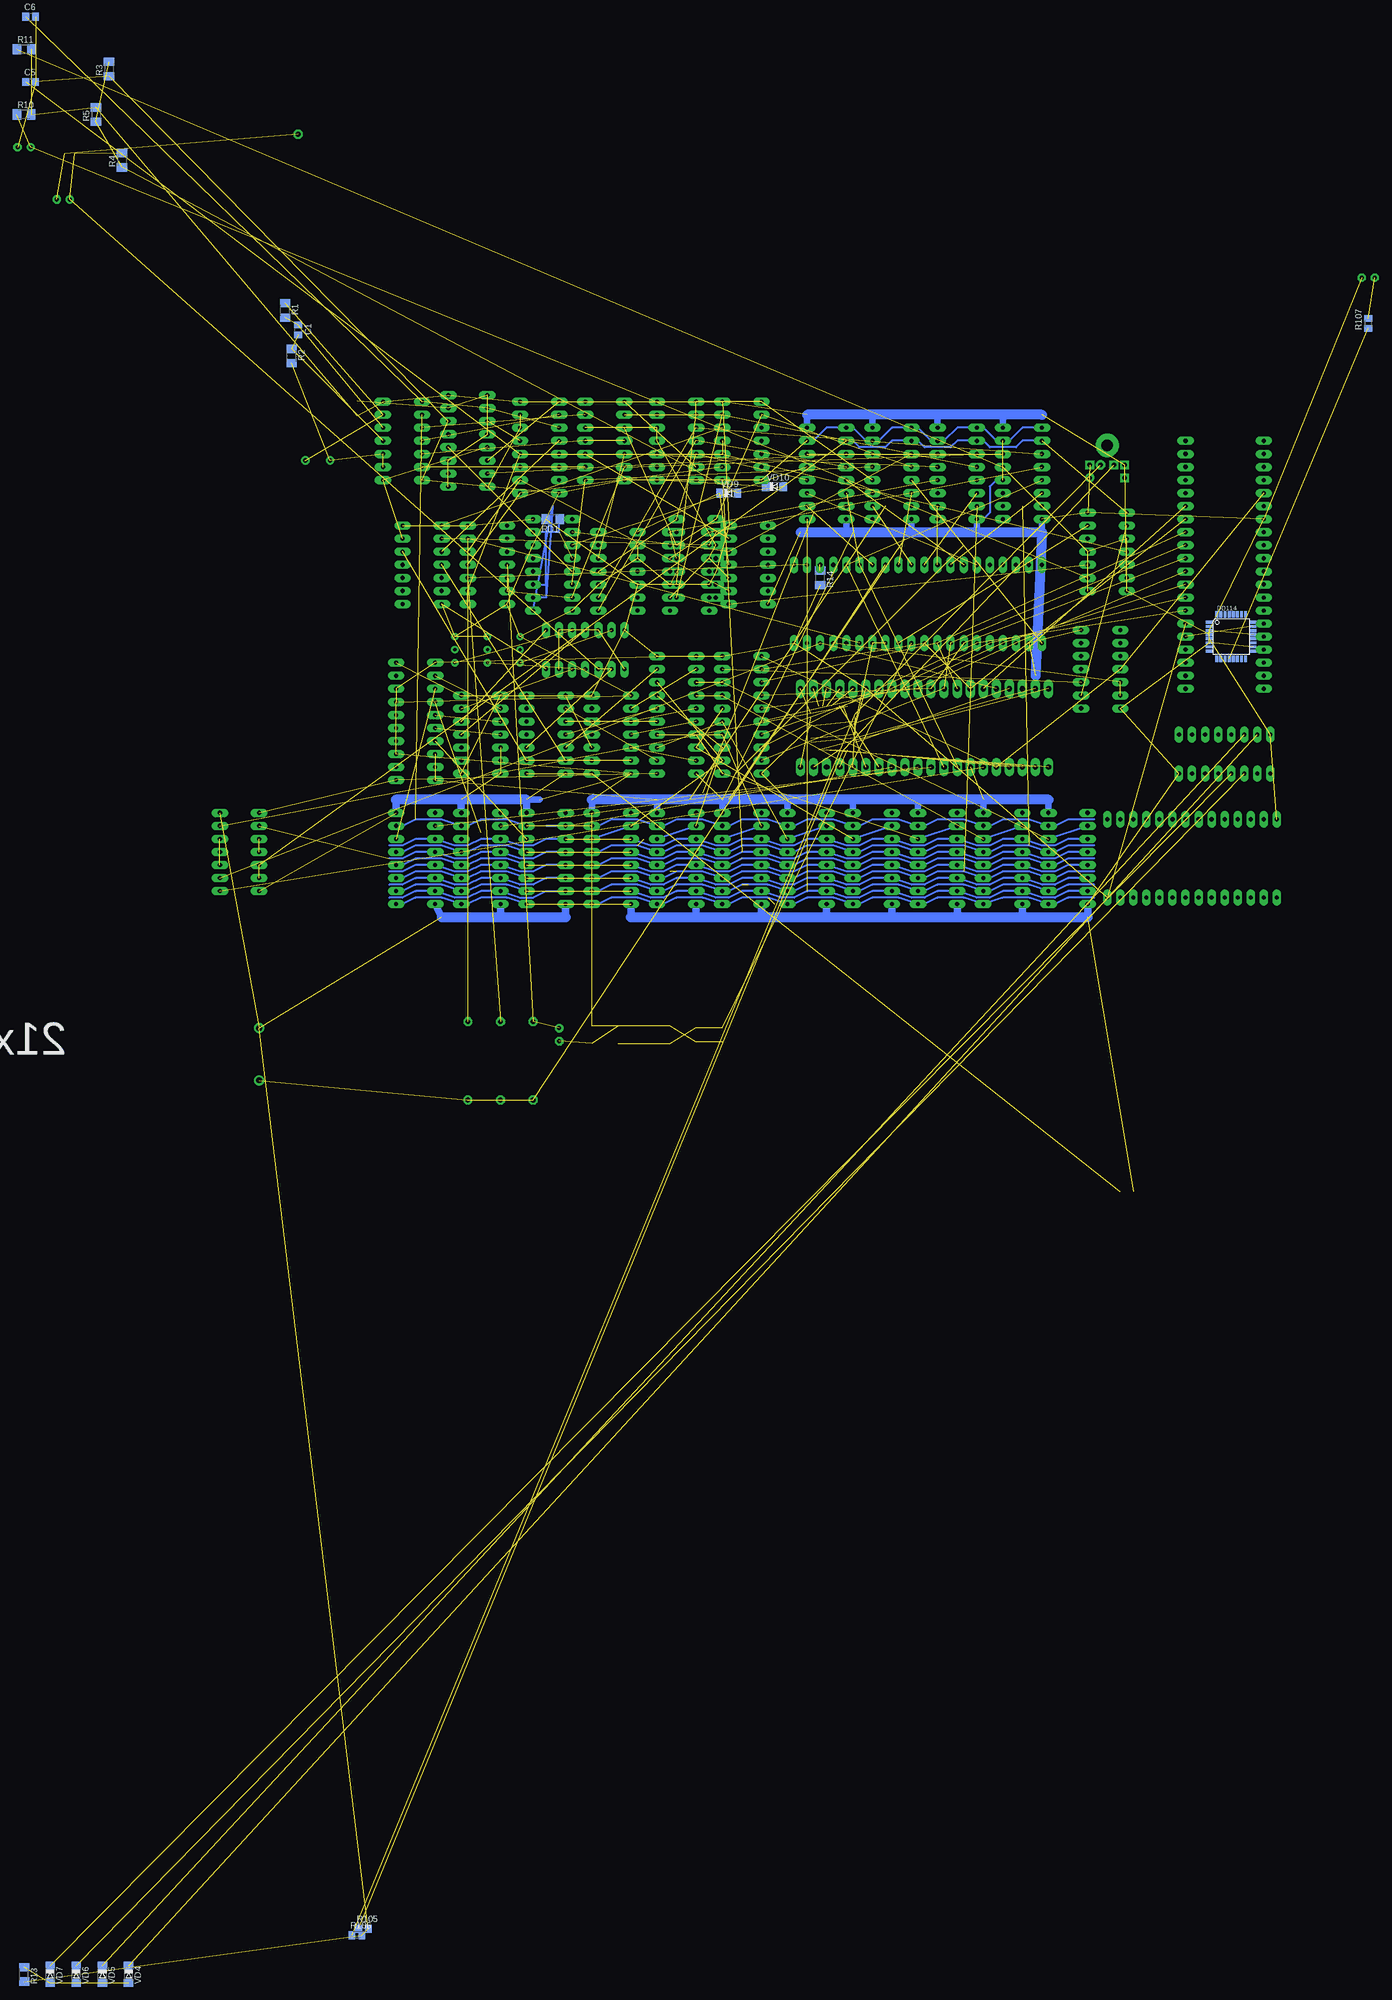
[diagram p5: board, bottom side, seen from below]

No outline drawn. Coordinates in mm, seen from the top.
Copper layers (1*16): Top 0.035mm / dielectric 1.5mm / Bottom 0.035mm
Design rules "speccy2007": minimum track width 10mil, minimum drill 24mil, track to track 8mil, track to pad 8mil, pad to pad 8mil, via to via 8mil, smd to smd 8mil, copper to edge 40mil, drill to drill 7mil, minimum pad ring 0.4mm, minimum via ring 8mil, stop-mask expansion 4mil, vias tented up to drill 0mil, thermal gap 10mil

### Footprints (pad centres in the part's own frame; a part is rotated, then mirrored left to right if it is on the bottom)
DIL28 = drill 0.813 long: 1 -16.51,-7.62; 2 -13.97,-7.62; 3 -11.43,-7.62; 4 -8.89,-7.62; 5 -6.35,-7.62; 6 -3.81,-7.62; 7 -1.27,-7.62; 8 1.27,-7.62; 9 3.81,-7.62; 10 6.35,-7.62; 11 8.89,-7.62; 12 11.43,-7.62; 13 13.97,-7.62; 14 16.51,-7.62; 15 16.51,7.62; 16 13.97,7.62; 17 11.43,7.62; 18 8.89,7.62; 19 6.35,7.62; 20 3.81,7.62; 21 1.27,7.62; 22 -1.27,7.62; 23 -3.81,7.62; 24 -6.35,7.62; 25 -8.89,7.62; 26 -11.43,7.62; 27 -13.97,7.62; 28 -16.51,7.62
C0805 = smd 1.3 x 1.5: 1 -0.95,0; 2 0.95,0
E2,5-5 = drill 0.813 pad 1.6: + -1.27,0 | drill 0.813 pad 1.6 octagon: - 1.27,0
C1206 = smd 1.6 x 1.8: 1 -1.4,0; 2 1.4,0
DIL14 = drill 0.813 long: 1 -7.62,-3.81; 2 -5.08,-3.81; 3 -2.54,-3.81; 4 0,-3.81; 5 2.54,-3.81; 6 5.08,-3.81; 7 7.62,-3.81; 8 7.62,3.81; 9 5.08,3.81; 10 2.54,3.81; 11 0,3.81; 12 -2.54,3.81; 13 -5.08,3.81; 14 -7.62,3.81
DIL16 = drill 0.813 long: 1 -8.89,-3.81; 2 -6.35,-3.81; 3 -3.81,-3.81; 4 -1.27,-3.81; 5 1.27,-3.81; 6 3.81,-3.81; 7 6.35,-3.81; 8 8.89,-3.81; 9 8.89,3.81; 10 6.35,3.81; 11 3.81,3.81; 12 1.27,3.81; 13 -1.27,3.81; 14 -3.81,3.81; 15 -6.35,3.81; 16 -8.89,3.81
DIL40 = drill 0.813 long: 1 -24.13,-7.62; 2 -21.59,-7.62; 3 -19.05,-7.62; 4 -16.51,-7.62; 5 -13.97,-7.62; 6 -11.43,-7.62; 7 -8.89,-7.62; 8 -6.35,-7.62; 9 -3.81,-7.62; 10 -1.27,-7.62; 11 1.27,-7.62; 12 3.81,-7.62; 13 6.35,-7.62; 14 8.89,-7.62; 15 11.43,-7.62; 16 13.97,-7.62; 17 16.51,-7.62; 18 19.05,-7.62; 19 21.59,-7.62; 20 24.13,-7.62; 21 24.13,7.62; 22 21.59,7.62; 23 19.05,7.62; 24 16.51,7.62; 25 13.97,7.62; 26 11.43,7.62; 27 8.89,7.62; 28 6.35,7.62; 29 3.81,7.62; 30 1.27,7.62; 31 -1.27,7.62; 32 -3.81,7.62; 33 -6.35,7.62; 34 -8.89,7.62; 35 -11.43,7.62; 36 -13.97,7.62; 37 -16.51,7.62; 38 -19.05,7.62; 39 -21.59,7.62; 40 -24.13,7.62
DIL20 = drill 0.813 long: 1 -11.43,-3.81; 2 -8.89,-3.81; 3 -6.35,-3.81; 4 -3.81,-3.81; 5 -1.27,-3.81; 6 1.27,-3.81; 7 3.81,-3.81; 8 6.35,-3.81; 9 8.89,-3.81; 10 11.43,-3.81; 11 11.43,3.81; 12 8.89,3.81; 13 6.35,3.81; 14 3.81,3.81; 15 1.27,3.81; 16 -1.27,3.81; 17 -3.81,3.81; 18 -6.35,3.81; 19 -8.89,3.81; 20 -11.43,3.81
TQFP32-08 = smd 1.27 x 0.559: 1 -4.293,2.8; 2 -4.293,2; 3 -4.293,1.2; 4 -4.293,0.4; 5 -4.293,-0.4; 6 -4.293,-1.2; 7 -4.293,-2; 8 -4.293,-2.8; 17 4.293,-2.8; 18 4.293,-2; 19 4.293,-1.2; 20 4.293,-0.4; 21 4.293,0.4; 22 4.293,1.2; 23 4.293,2; 24 4.293,2.8 | smd 0.559 x 1.27: 9 -2.8,-4.293; 10 -2,-4.293; 11 -1.2,-4.293; 12 -0.4,-4.293; 13 0.4,-4.293; 14 1.2,-4.293; 15 2,-4.293; 16 2.8,-4.293; 25 2.8,4.293; 26 2,4.293; 27 1.2,4.293; 28 0.4,4.293; 29 -0.4,4.293; 30 -1.2,4.293; 31 -2,4.293; 32 -2.8,4.293
1X20 = drill 1.016 long: 1 -24.13,0; 2 -21.59,0; 3 -19.05,0; 4 -16.51,0; 5 -13.97,0; 6 -11.43,0; 7 -8.89,0; 8 -6.35,0; 9 -3.81,0; 10 -1.27,0; 11 1.27,0; 12 3.81,0; 13 6.35,0; 14 8.89,0; 15 11.43,0; 16 13.97,0; 17 16.51,0; 18 19.05,0; 19 21.59,0; 20 24.13,0
1X01 = drill 1.016 octagon: 1 0,0
MINI-DIN6 = drill 0.9 pad 1.676 square: 1 -1.3,-8.5; 3 -3.4,-8.5; 4 3.4,-8.5; 5 -3.4,-11 | drill 0.9 pad 1.778: 2 1.3,-8.5; 6 3.4,-11 | drill 2.2 pad 4.5: GND 0,-4.7
LED5MM = drill 0.813 octagon: A -1.27,0; K 1.27,0
M1206 = smd 1.6 x 2: 1 -1.4,0; 2 1.4,0
0411/15 = drill 0.914 octagon: 1 -7.62,0; 2 7.62,0
RTRIM3296W = drill 0.61: 1 0,-2.54; 2 0,0; 3 0,2.54
M0805 = smd 1.3 x 1.6: 1 -0.95,0; 2 0.95,0
PCB-MAIN = hole 7: 203.5,30.5; 57.5,30.5; 203.5,132; 57.5,132 | hole 12: 79.5,76.5; 184,76.5
SOD80C = smd 1.4 x 1.8: A 1.7,0; C -1.7,0
DO41-10 = drill 1.118: A 5.08,0; C -5.08,0
HC49/S = drill 0.813: 1 -2.413,0; 2 2.413,0

### Placement (x,y rotation side)
27512  45.72,87.63 180 top
C1  219.71,190.5 270 bottom
C3  168.91,53.34 270 top
C4  137.16,53.34 270 top
C4'  142.24,53.34 270 top
C5  271.78,238.76 0 bottom
C6  271.78,251.46 0 bottom
C7  273.05,226.06 0 top
C10  265.43,215.9 0 top
C11  264.16,224.79 0 top
DD1  199.39,168.91 270 top
DD2  170.18,144.78 270 top
DD3  157.48,143.51 270 top
DD4  142.24,146.05 270 top
DD5  143.51,143.51 270 top
DD6  160.02,168.91 270 top
DD7  133.35,168.91 270 top
DD8  186.69,168.91 270 top
DD9  195.58,144.78 270 top
DD10  146.05,168.91 270 top
DD11  132.08,144.78 270 top
DD12  62.23,147.32 90 top
DD14  63.5,124.46 90 top
DD15  116.84,162.56 270 top
DD16  104.14,162.56 270 top
DD17  91.44,162.56 270 top
DD18  78.74,162.56 270 top
DD20  182.88,144.78 270 top
DD21  69.85,87.63 270 top
DD22  82.55,87.63 270 top
DD23  95.25,87.63 270 top
DD24  107.95,87.63 270 top
DD25  120.65,87.63 270 top
DD26  133.35,87.63 270 top
DD27  146.05,87.63 270 top
DD28  158.75,87.63 270 top
DD29  99.06,137.16 0 top
DD30  97.79,113.03 0 top
DD31  146.05,115.57 270 top
DD32  158.75,111.76 270 top
DD33  171.45,111.76 270 top
DD34  133.35,115.57 270 top
DD36  39.37,107.95 180 top
DD40  172.72,167.64 270 top
DD102  196.85,87.63 270 top
DD103  184.15,87.63 270 top
DD104  171.45,87.63 270 top
DD107  231.14,88.9 270 top
DD108  196.85,114.3 270 top
DD109  184.15,111.76 270 top
DD110  163.83,128.27 0 top
DD112  39.37,144.78 270 top
DD113  115.57,113.03 0 top
DD114  38.1,130.81 0 bottom
DD3011.1  97.79,105.41 0 top
DD3011.2  97.79,120.65 0 top
JP1  219.71,228.6 180 top
KB  62.23,172.72 0 top
LED1  11.43,200.66 0 top
R1  222.25,194.31 270 bottom
R2  220.98,185.42 270 bottom
R3  256.54,241.3 90 bottom
R4  254,223.52 90 bottom
R5  259.08,232.41 90 bottom
R6  173.99,48.26 270 top
R7  182.88,128.27 0 top
R8  189.23,128.27 0 top
R9  176.53,128.27 0 top
R10  273.05,232.41 0 bottom
R11  273.05,245.11 0 bottom
R13  273.05,-129.54 270 bottom
R14  118.11,142.24 270 bottom
R23  58.42,22.86 180 top
R47  186.69,48.26 270 top
R48  180.34,48.26 270 top
R105  207.01,-120.65 0 bottom
R106  208.28,-121.92 0 bottom
R107  11.43,191.77 90 bottom
RD1  170.18,153.67 180 bottom
RD2  208.28,175.26 90 top
U$1  [PCB-MAIN]  309.88,87.63 0 top
VD1  162.56,53.34 270 top
VD2  157.48,53.34 270 top
VD3  152.4,53.34 270 top
VD3*  147.32,53.34 270 top
VD4  252.73,-129.54 270 bottom
VD5  257.81,-129.54 270 bottom
VD6  262.89,-129.54 270 bottom
VD7  267.97,-129.54 270 bottom
VD8  227.33,49.53 90 top
VD9  135.89,158.75 0 bottom
VD10  127,160.02 0 bottom
Z1  215.9,165.1 180 top

### Tracks (layer width: path | path; a pad name or v marks a point on that pad's centre or on a via)
!CAS  (2 unrouted)
  Bottom 0.406: DD28.15 161.29,93.98 158.75,95.25 153.67,95.25 DD27.15 148.59,93.98 146.05,95.25 140.97,95.25 DD26.15 135.89,93.98 133.35,95.25 128.27,95.25 DD25.15 123.19,93.98 120.65,95.25 115.57,95.25 DD24.15 110.49,93.98 107.95,95.25 102.87,95.25 DD23.15 97.79,93.98 95.25,95.25 90.17,95.25 DD22.15 85.09,93.98 82.55,95.25 77.47,95.25 DD21.15 72.39,93.98 69.85,95.25 64.77,95.25 | DD104.15 179.07,95.25 184.15,95.25 186.69,93.98 DD103.15 191.77,95.25 196.85,95.25 199.39,93.98 DD102.15
!RAS  (3 unrouted)
  Bottom 0.406: DD28.4 151.13,87.63 148.59,87.63 146.05,88.9 DD27.4 138.43,87.63 135.89,87.63 133.35,88.9 DD26.4 125.73,87.63 123.19,87.63 120.65,88.9 DD25.4 113.03,87.63 110.49,87.63 107.95,88.9 DD24.4 100.33,87.63 97.79,87.63 95.25,88.9 DD23.4 87.63,87.63 85.09,87.63 82.55,88.9 DD22.4 74.93,87.63 72.39,87.63 69.85,88.9 DD21.4 | 201.93,87.63 199.39,87.63 196.85,88.9 DD102.4 189.23,87.63 186.69,87.63 184.15,88.9 DD103.4 176.53,87.63 173.99,87.63 171.45,88.9 DD104.4
!RD  (3 unrouted)
!U7  (1 unrouted)
!WE  (1 unrouted)
  Bottom 0.406: DD28.3 151.13,90.17 148.59,90.17 146.05,91.44 DD27.3 138.43,90.17 135.89,90.17 133.35,91.44 DD26.3 125.73,90.17 123.19,90.17 120.65,91.44 DD25.3 113.03,90.17 110.49,90.17 107.95,91.44 DD24.3 100.33,90.17 97.79,90.17 95.25,91.44 DD23.3 87.63,90.17 85.09,90.17 82.55,91.44 DD22.3 74.93,90.17 72.39,90.17 69.85,91.44 DD21.3 | DD104.3 171.45,91.44 173.99,90.17 176.53,90.17 DD103.3 184.15,91.44 186.69,90.17 189.23,90.17 DD102.3 196.85,91.44 199.39,90.17 201.93,90.17
!WR  (2 unrouted)
+5V  (45 unrouted)
  Bottom 0.406: RD1.2 DD2.16
  Bottom 1.27: DD18.16 82.55,173.99 | DD17.16 95.25,173.99 | DD16.16 107.95,173.99 | DD15.16 120.65,173.99
  Bottom 1.422: DD21.8 66.04,76.2 | DD22.8 78.74,76.2 | DD23.8 91.44,76.2 | DD24.8 104.14,76.2 | DD25.8 116.84,76.2 | DD26.8 129.54,76.2 | DD27.8 142.24,76.2 | 154.94,76.2 DD28.8 | DD104.8 167.64,76.2 | DD103.8 180.34,76.2 | DD102.8 191.77,76.2
  Bottom 1.93: 154.94,76.2 142.24,76.2 129.54,76.2 116.84,76.2 104.14,76.2 91.44,76.2 78.74,76.2 66.04,76.2 | 191.77,76.2 180.34,76.2 167.64,76.2 | 74.93,173.99 82.55,173.99 95.25,173.99 107.95,173.99 120.65,173.99
+12V  (4 unrouted)
-5V  (5 unrouted)
A0  (2 unrouted)
A1  (2 unrouted)
A2  (1 unrouted)
A3  (1 unrouted)
A4  (1 unrouted)
A5  (1 unrouted)
A6  (1 unrouted)
A7  (1 unrouted)
A8  (1 unrouted)
A9  (1 unrouted)
A10  (1 unrouted)
B  (1 unrouted)
  Bottom 0.406: DD104.2 171.45,93.98
B0  (1 unrouted)
CRG  (2 unrouted)
D0  (3 unrouted)
D1  (3 unrouted)
D2  (3 unrouted)
D3  (3 unrouted)
D4  (3 unrouted)
D5  (3 unrouted)
D6  (3 unrouted)
D7  (3 unrouted)
F1  (2 unrouted)
F2  (2 unrouted)
G  (1 unrouted)
G0  (1 unrouted)
  Top 0.406: 184.15,92.71 185.42,91.44 DD103.14
G1  (1 unrouted)
G2  (1 unrouted)
G3  (2 unrouted)
G4  (2 unrouted)
G5  (5 unrouted)
G6  (2 unrouted)
G7  (2 unrouted)
G8  (2 unrouted)
G9  (3 unrouted)
G10  (4 unrouted)
G11  (4 unrouted)
G12  (3 unrouted)
G13  (2 unrouted)
G14  (2 unrouted)
G15  (3 unrouted)
G16  (6 unrouted)
G17  (2 unrouted)
G18  (6 unrouted)
G19  (3 unrouted)
  Bottom 0.406: DD18.2 78.74,168.91 80.01,167.64 85.09,167.64 86.36,168.91 DD17.2 91.44,168.91 92.71,167.64 97.79,167.64 99.06,168.91 DD16.2 104.14,168.91 105.41,167.64 110.49,167.64 111.76,168.91 DD15.2
GND  (68 unrouted)
  Bottom 0.406: DD18.1 78.74,171.45 81.28,168.91 DD18.15 83.82,168.91 86.36,171.45 DD17.1 91.44,171.45 93.98,168.91 DD17.15 96.52,168.91 99.06,171.45 DD16.1 104.14,171.45 106.68,168.91 DD16.15 109.22,168.91 111.76,171.45 DD15.1 116.84,171.45 119.38,168.91 DD15.15 | DD18.12 83.82,161.29 85.09,160.02 85.09,154.94 86.36,153.67 DD17.8
  Bottom 1.27: DD21.16 73.66,99.06 | DD22.16 86.36,99.06 | DD23.16 99.06,99.06 | DD24.16 111.76,99.06 | DD28.16 162.56,99.06 | DD27.16 149.86,99.06 | DD26.16 137.16,99.06 | DD25.16 124.46,99.06 | DD15.8 113.03,151.13 | DD16.8 100.33,151.13 | DD17.8 87.63,151.13 | DD18.8 74.93,151.13 | 172.72,99.06 175.26,99.06
  Bottom 1.422: DD104.16 175.26,99.06 | DD102.16 200.66,99.06 | DD103.16 187.96,99.06
  Bottom 1.93: 73.66,99.06 86.36,99.06 99.06,99.06 111.76,99.06 124.46,99.06 137.16,99.06 149.86,99.06 162.56,99.06 | 175.26,99.06 187.96,99.06 200.66,99.06 | 121.92,151.13 113.03,151.13 100.33,151.13 87.63,151.13 74.93,151.13 76.2,123.19
K1  (1 unrouted)
K2  (1 unrouted)
K3  (1 unrouted)
K4  (1 unrouted)
K5  (1 unrouted)
K6  (2 unrouted)
K8  (1 unrouted)
K9  (1 unrouted)
K10  (1 unrouted)
K11  (1 unrouted)
K12  (1 unrouted)
K13  (1 unrouted)
K14  (1 unrouted)
K15  (1 unrouted)
K16  (1 unrouted)
K17  (1 unrouted)
K18  (1 unrouted)
K19  (1 unrouted)
K20  (2 unrouted)
LED  (1 unrouted)
MA0  (2 unrouted)
  Top 0.406: DD15.7 118.11,156.21 119.38,154.94 | 140.97,100.33 144.78,96.52 144.78,87.63 143.51,86.36 DD27.5
  Bottom 0.406: DD28.5 151.13,85.09 148.59,85.09 146.05,86.36 DD27.5 138.43,85.09 135.89,85.09 133.35,86.36 DD26.5 125.73,85.09 123.19,85.09 120.65,86.36 DD25.5 113.03,85.09 110.49,85.09 107.95,86.36 DD24.5 100.33,85.09 97.79,85.09 95.25,86.36 DD23.5 87.63,85.09 85.09,85.09 82.55,86.36 DD22.5 74.93,85.09 72.39,85.09 69.85,86.36 DD21.5 | DD104.5 171.45,86.36 173.99,85.09 176.53,85.09 DD103.5 184.15,86.36 186.69,85.09 189.23,85.09 DD102.5 196.85,86.36 199.39,85.09 201.93,85.09
MA1  (2 unrouted)
  Bottom 0.406: DD28.7 151.13,80.01 148.59,80.01 146.05,81.28 DD27.7 138.43,80.01 135.89,80.01 133.35,81.28 DD26.7 125.73,80.01 123.19,80.01 120.65,81.28 DD25.7 113.03,80.01 110.49,80.01 107.95,81.28 DD24.7 100.33,80.01 97.79,80.01 95.25,81.28 DD23.7 87.63,80.01 85.09,80.01 82.55,81.28 DD22.7 74.93,80.01 72.39,80.01 69.85,81.28 DD21.7 | 201.93,80.01 199.39,80.01 196.85,81.28 DD102.7 189.23,80.01 186.69,80.01 184.15,81.28 DD103.7 176.53,80.01 173.99,80.01 171.45,81.28 DD104.7
MA2  (3 unrouted)
  Top 0.406: DD16.7 105.41,156.21 106.68,157.48 | 143.51,99.06 146.05,96.52 146.05,83.82
  Bottom 0.406: DD28.6 151.13,82.55 148.59,82.55 146.05,83.82 DD27.6 138.43,82.55 135.89,82.55 133.35,83.82 DD26.6 125.73,82.55 123.19,82.55 120.65,83.82 DD25.6 113.03,82.55 110.49,82.55 107.95,83.82 DD24.6 100.33,82.55 97.79,82.55 95.25,83.82 DD23.6 87.63,82.55 85.09,82.55 82.55,83.82 DD22.6 74.93,82.55 72.39,82.55 69.85,83.82 DD21.6 | DD104.6 171.45,83.82 173.99,82.55 176.53,82.55 DD103.6 184.15,83.82 186.69,82.55 189.23,82.55 DD102.6 196.85,83.82 199.39,82.55 201.93,82.55
MA3  (3 unrouted)
  Top 0.406: DD16.9 109.22,153.67 111.76,151.13 | 137.16,99.06 134.62,96.52 134.62,88.14 133.86,87.38
  Bottom 0.406: DD28.12 161.29,86.36 158.75,87.63 153.67,87.63 DD27.12 148.59,86.36 146.05,87.63 140.97,87.63 DD26.12 135.89,86.36 133.35,87.63 128.27,87.63 DD25.12 123.19,86.36 120.65,87.63 115.57,87.63 DD24.12 110.49,86.36 107.95,87.63 102.87,87.63 DD23.12 97.79,86.36 95.25,87.63 90.17,87.63 DD22.12 85.09,86.36 82.55,87.63 77.47,87.63 DD21.12 72.39,86.36 69.85,87.63 64.77,87.63 | DD104.12 179.07,87.63 184.15,87.63 186.69,86.36 DD103.12 191.77,87.63 196.85,87.63 199.39,86.36 DD102.12
MA4  (3 unrouted)
  Top 0.406: DD17.7 92.71,156.21 93.98,157.48 104.14,157.48 106.68,160.02 | 146.05,97.79 147.32,96.52 147.32,85.09
  Bottom 0.406: DD28.11 161.29,83.82 158.75,85.09 153.67,85.09 DD27.11 148.59,83.82 146.05,85.09 140.97,85.09 DD26.11 135.89,83.82 133.35,85.09 128.27,85.09 DD25.11 123.19,83.82 120.65,85.09 115.57,85.09 DD24.11 110.49,83.82 107.95,85.09 102.87,85.09 DD23.11 97.79,83.82 95.25,85.09 90.17,85.09 DD22.11 85.09,83.82 82.55,85.09 77.47,85.09 DD21.11 72.39,83.82 69.85,85.09 64.77,85.09 | DD104.11 179.07,85.09 184.15,85.09 186.69,83.82 DD103.11 191.77,85.09 196.85,85.09 199.39,83.82 DD102.11
MA5  (3 unrouted)
  Top 0.406: DD17.9 97.79,153.67 101.6,149.86 | 135.89,99.06 132.08,95.25 132.08,82.55
  Bottom 0.406: DD28.10 161.29,81.28 158.75,82.55 153.67,82.55 DD27.10 148.59,81.28 146.05,82.55 140.97,82.55 DD26.10 135.89,81.28 133.35,82.55 128.27,82.55 DD25.10 123.19,81.28 120.65,82.55 115.57,82.55 DD24.10 110.49,81.28 107.95,82.55 102.87,82.55 DD23.10 97.79,81.28 95.25,82.55 90.17,82.55 DD22.10 85.09,81.28 82.55,82.55 77.47,82.55 DD21.10 72.39,81.28 69.85,82.55 64.77,82.55 | DD104.10 179.07,82.55 184.15,82.55 186.69,81.28 DD103.10 191.77,82.55 196.85,82.55 199.39,81.28 DD102.10
MA6  (3 unrouted)
  Top 0.406: DD18.7 78.74,156.21 80.01,157.48 80.01,161.29 81.28,162.56 | 148.59,101.6 152.4,97.79 152.4,91.44
  Bottom 0.406: DD28.13 161.29,88.9 158.75,90.17 153.67,90.17 DD27.13 148.59,88.9 146.05,90.17 140.97,90.17 DD26.13 135.89,88.9 133.35,90.17 128.27,90.17 DD25.13 123.19,88.9 120.65,90.17 115.57,90.17 DD24.13 110.49,88.9 107.95,90.17 102.87,90.17 DD23.13 97.79,88.9 95.25,90.17 90.17,90.17 DD22.13 85.09,88.9 82.55,90.17 77.47,90.17 DD21.13 72.39,88.9 69.85,90.17 64.77,90.17 | DD104.13 179.07,90.17 184.15,90.17 186.69,88.9 DD103.13 191.77,90.17 196.85,90.17 199.39,88.9 DD102.13
MA7  (3 unrouted)
  Top 0.406: DD18.9 85.09,153.67 90.17,148.59 | 134.62,104.14 127,96.52 127,78.74
  Bottom 0.406: DD28.9 161.29,78.74 158.75,80.01 153.67,80.01 DD27.9 148.59,78.74 146.05,80.01 140.97,80.01 DD26.9 135.89,78.74 133.35,80.01 128.27,80.01 DD25.9 123.19,78.74 120.65,80.01 115.57,80.01 DD24.9 110.49,78.74 107.95,80.01 102.87,80.01 DD23.9 97.79,78.74 95.25,80.01 90.17,80.01 DD22.9 82.55,80.01 77.47,80.01 DD21.9 72.39,78.74 69.85,80.01 64.77,80.01 | DD104.9 179.07,80.01 184.15,80.01 186.69,78.74 DD103.9 191.77,80.01 196.85,80.01 199.39,78.74 DD102.9
MD0  (2 unrouted)
  Bottom 0.406: DD21.2 DD21.14
MD1  (2 unrouted)
  Bottom 0.406: DD22.2 DD22.14
MD2  (2 unrouted)
  Bottom 0.406: DD23.2 DD23.14
MD3  (2 unrouted)
  Bottom 0.406: DD24.2 DD24.14
MD4  (2 unrouted)
  Bottom 0.406: DD25.2 DD25.14
MD5  (2 unrouted)
  Bottom 0.406: DD26.2 DD26.14
MD6  (2 unrouted)
  Bottom 0.406: DD27.2 DD27.14
MD7  (2 unrouted)
  Bottom 0.406: DD28.2 DD28.14
N$1  (1 unrouted)
N$2  (2 unrouted)
N$3  (2 unrouted)
N$4  (1 unrouted)
N$5  (2 unrouted)
N$6  (3 unrouted)
N$7  (2 unrouted)
N$8  (2 unrouted)
N$9  (1 unrouted)
N$10  (1 unrouted)
N$11  (1 unrouted)
N$12  (1 unrouted)
N$13  (1 unrouted)
N$14  (1 unrouted)
N$15  (1 unrouted)
N$16  (2 unrouted)
N$17  (1 unrouted)
N$18  (4 unrouted)
N$19  (2 unrouted)
N$20  (1 unrouted)
N$21  (2 unrouted)
N$22  (2 unrouted)
N$23  (1 unrouted)
N$24  (1 unrouted)
N$25  (1 unrouted)
N$26  (2 unrouted)
N$27  (4 unrouted)
N$28  (1 unrouted)
N$29  (1 unrouted)
  Bottom 0.406: 171.45,151.13 168.91,151.13 168.91,153.54 RD1.1 | 171.45,151.13 DD2.15 | DD2.9 170.18,156.21 171.45,138.43 | 171.45,138.43 DD2.10 | DD2.11 171.45,140.97 | 171.45,140.97 171.45,138.43 | 171.45,140.97 171.45,151.13 | 168.91,153.67 RD1.1 | RD1.1 DD2.1
N$31  (5 unrouted)
N$33  (2 unrouted)
N$34  (1 unrouted)
N$35  (2 unrouted)
N$37  (1 unrouted)
N$38  (6 unrouted)
N$39  (2 unrouted)
N$40  (2 unrouted)
N$41  (3 unrouted)
N$42  (3 unrouted)
N$43  (1 unrouted)
N$44  (1 unrouted)
N$45  (1 unrouted)
N$46  (1 unrouted)
N$48  (1 unrouted)
N$49  (2 unrouted)
N$50  (1 unrouted)
N$51  (1 unrouted)
N$52  (1 unrouted)
N$53  (2 unrouted)
N$54  (1 unrouted)
N$55  (1 unrouted)
N$56  (1 unrouted)
N$57  (2 unrouted)
N$66  (1 unrouted)
N$69  (1 unrouted)
N$70  (1 unrouted)
P16  (1 unrouted)
R  (1 unrouted)
R0  (1 unrouted)
R2  (1 unrouted)
RD  (2 unrouted)
RES  (1 unrouted)
RES80  (1 unrouted)
U7  (1 unrouted)
VCC  (2 unrouted)
VD0  (1 unrouted)
VD1  (1 unrouted)
VD2  (1 unrouted)
VD3  (1 unrouted)
VD4  (1 unrouted)
VD5  (1 unrouted)
VD6  (1 unrouted)
VD7  (1 unrouted)
VID  (5 unrouted)

### Text on the board
bPlace: 21x13 | 220х135 вост экс нов